# Altium project BMS_2020.PrjPcb (part 1 of 2)
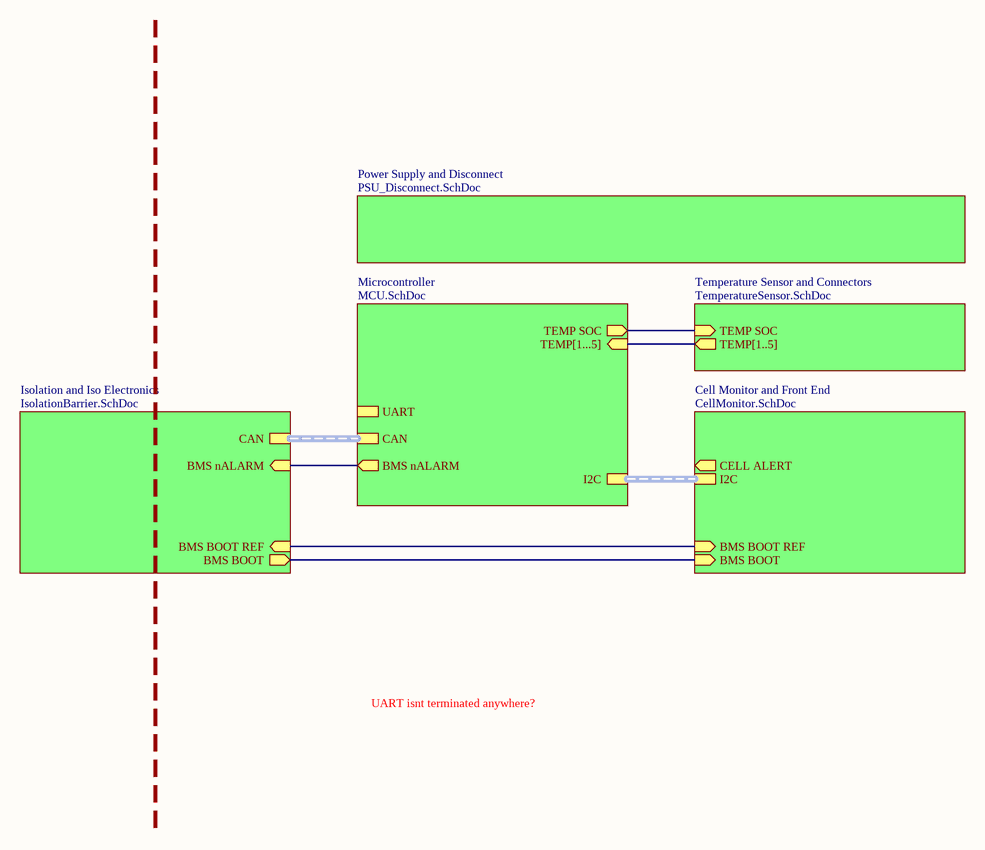
[diagram p0: Master.SchDoc]
9 sheets, 168 parts. Net scope: hierarchical (ports join the sheet entries above them; power ports are global).
Sheets:
  Master.SchDoc
    Isolation and Iso Electronics = IsolationBarrier.SchDoc
      Isolated CANBUS = CANBUS_3V3_Isolated.SchDoc
    Microcontroller = MCU.SchDoc
    Cell Monitor and Front End = CellMonitor.SchDoc
      CELL 10 INTERFACE = ExternalBalancing.SchDoc
      CELL 1 INTERFACE = ExternalBalancing.SchDoc
      CELL 2 INTERFACE = ExternalBalancing.SchDoc
      CELL 3 INTERFACE = ExternalBalancing.SchDoc
      CELL 4 INTERFACE = ExternalBalancing.SchDoc
      CELL 5 INTERFACE = ExternalBalancing.SchDoc
      CELL 6 INTERFACE = ExternalBalancing.SchDoc
      CELL 7 INTERFACE = ExternalBalancing.SchDoc
      CELL 8 INTERFACE = ExternalBalancing.SchDoc
      CELL 9 INTERFACE = ExternalBalancing.SchDoc
    Power Supply and Disconnect = PSU_Disconnect.SchDoc
    Temperature Sensor and Connectors = TemperatureSensor.SchDoc
      FlexPCBTempSensors1 = TemperatureSensors.SchDoc
      FlexPCBTempSensors2 = TemperatureSensors.SchDoc
      FlexPCBTempSensors3 = TemperatureSensors.SchDoc
      FlexPCBTempSensors4 = TemperatureSensors.SchDoc

## Sheet Master.SchDoc: BMS Master
size A4; DrawnBy: Jonn Dillon; DocumentNumber: 1; Revision: 01; SheetNumber: 1; SheetTotal: 10; Version: 01; Project: Battery Managment System 2020; PageSetup: Record=PageOptions|CenterHorizontal=True|CenterVertical=True|PrintScale=0.97|XCorrection=1.00|YCorrection=1.00|PrintKind=0|BorderSize=5000000|LeftOffset=0|BottomOffset=0|Orientation=2|PaperLength=1000|PaperWidth=1000|Scale=100|PaperSource=7|PrintQuality=-4|MediaType=1|DitherType=10|PaperKind=A4|PrintScaleMode=1

### Sub-sheets
Cell Monitor and Front End = CellMonitor.SchDoc: BMS BOOT REF (in), BMS BOOT (in), I2C (harness I2C), CELL ALERT (out)
Isolation and Iso Electronics = IsolationBarrier.SchDoc: BMS BOOT (out), CAN (harness CANBUS SERIAL), BMS nALARM (in), BMS BOOT REF (in)
Microcontroller = MCU.SchDoc: I2C (harness I2C), CAN (harness CAN), TEMP[1...5] (in), BMS nALARM (out), TEMP SOC (out), UART (harness UART)
Power Supply and Disconnect = PSU_Disconnect.SchDoc: no entries
Temperature Sensor and Connectors = TemperatureSensor.SchDoc: TEMP SOC (in), TEMP[1..5] (out)

### Nets
BMS BOOT: sheet Isolation and Iso Electronics/BMS BOOT, sheet Cell Monitor and Front End/BMS BOOT
nALARM: sheet Isolation and Iso Electronics/BMS nALARM, sheet Microcontroller/BMS nALARM
TEMP SOC: sheet Microcontroller/TEMP SOC, sheet Temperature Sensor and Connectors/TEMP SOC
NetR?#11_2: sheet Isolation and Iso Electronics/BMS BOOT REF, sheet Cell Monitor and Front End/BMS BOOT REF

### Buses and harness runs
bus sheet Microcontroller/TEMP[1...5] = sheet Temperature Sensor and Connectors/TEMP[1..5]
harness sheet Cell Monitor and Front End/I2C = sheet Microcontroller/I2C
harness sheet Isolation and Iso Electronics/CAN = sheet Microcontroller/CAN

### Notes on the sheet
- UART isnt terminated anywhere?
- Revision History:
- Sheet Title:
- Rev
- Date
- Description
- Project:
- Size:
- Drawn By:
- A3
- Number:
- Revision:
- Sheet
- Version:
- of
- QUT Motorsport
- O-120, Gardens Point
- 2 George Street
- Brisbane, QLD 4000
- Australia
- Print Date:
- Print Time:
- File Name:

## Sheet IsolationBarrier.SchDoc: Isolation Barrier
size A3; DrawnBy: Jonn Dillon; DocumentNumber: 3; Revision: 01; SheetNumber: 3; SheetTotal: 10; Version: 01; Project: Battery Management System 2020; PageSetup: Record=PageOptions|CenterHorizontal=True|CenterVertical=True|PrintScale=0.97|XCorrection=1.00|YCorrection=1.00|PrintKind=0|BorderSize=5000000|LeftOffset=0|BottomOffset=0|Orientation=2|PaperLength=1000|PaperWidth=1000|Scale=100|PaperSource=7|PrintQuality=-4|MediaType=1|DitherType=10|PaperKind=A4|PrintScaleMode=1
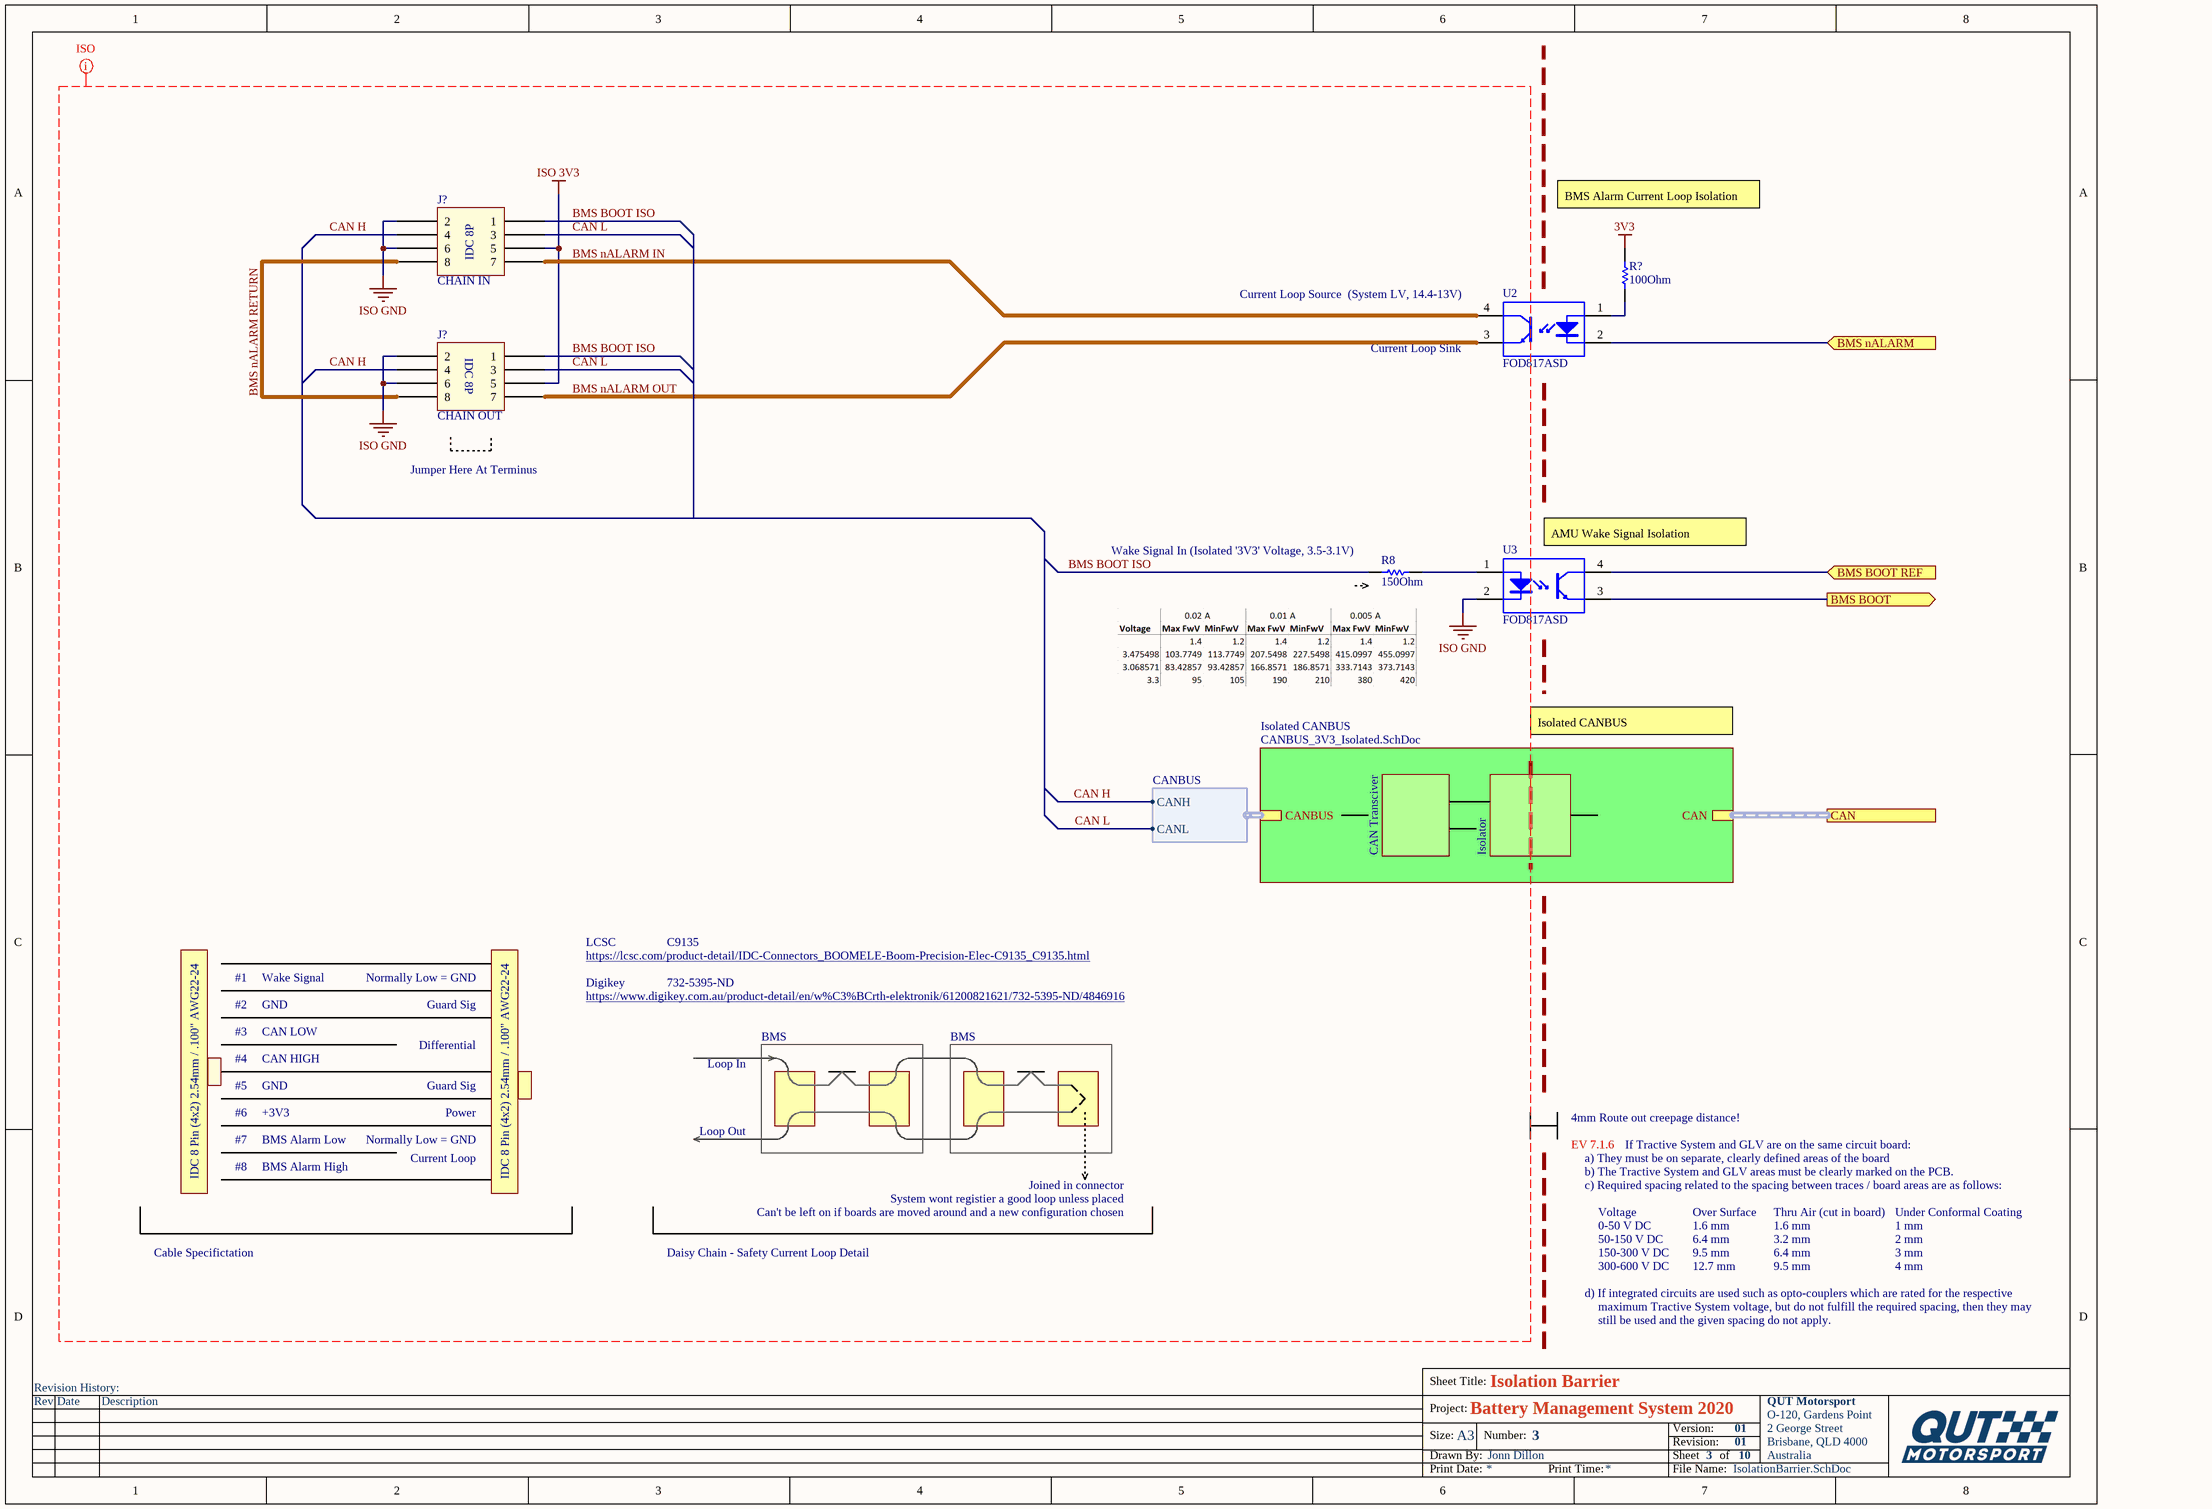
[diagram p1: IsolationBarrier.SchDoc]

### Parts
(Parts that share a designator on the sheet are numbered #1, #2 ... from top to bottom, then left to right.)
J?#1  CHAIN IN  [IDC_8P]
J?#2  CHAIN OUT  [IDC_8P]
R8  150Ohm  [RESC1608X55X30NL15T15]
R?#1  100Ohm  [RESC1608X55X25ML10T15]
U2  FOD817ASD  [FAIR-MDIP-4_V]
U3  FOD817ASD  [FAIR-MDIP-4_V]

### Sub-sheets
Isolated CANBUS = CANBUS_3V3_Isolated.SchDoc: CANBUS (harness CANBUS), CAN

### Ports
BMS BOOT (out), BMS BOOT REF (in), BMS nALARM (in), CAN (harness CANBUS SERIAL)

### Harnesses
CANBUS: CANH, CANL

### Nets
3V3: R?#1.2
ISO 3V3: J?#1.5 J?#2.5
ISO GND: J?#1.2 J?#1.6 J?#2.2 J?#2.6 U3.2(CATHODE)
BMS BOOT: U3.3(EMITTER) ; port BMS BOOT
BMS BOOT ISO: J?#1.1 J?#2.1 R8.1
BMS nALARM IN: J?#1.7 U2.4(COLLECTOR)
BMS nALARM OUT: J?#2.7 U2.3(EMITTER)
BMS nALARM RETURN: J?#1.8 J?#2.8
CAN H: J?#1.4 J?#2.4 ; sheet Isolated CANBUS/CANBUS.CANH
CAN L: J?#1.3 J?#2.3 ; sheet Isolated CANBUS/CANBUS.CANL
nALARM: U2.2(CATHODE) ; port BMS nALARM
NetR8_2: R8.2 U3.1(ANODE)
NetR?#1_1: R?#1.1 U2.1(ANODE)
NetR?#11_2: U3.4(COLLECTOR) ; port BMS BOOT REF

### Buses and harness runs
harness port CAN = sheet Isolated CANBUS/CAN

### Layout directives
mark named ISO: BMS BOOT ISO, BMS nALARM IN, BMS nALARM OUT, BMS nALARM RETURN, CAN H, CAN L, ISO 3V3, ISO GND

### Notes on the sheet
- BMS Alarm Current Loop Isolation
- (near U2) Current Loop Source  (System LV, 14.4-13V)
- (near U2) Current Loop Sink
- Jumper Here At Terminus
- (near R8) Wake Signal In (Isolated '3V3' Voltage, 3.5-3.1V)
- (near U3) AMU Wake Signal Isolation
- Isolated CANBUS
- CAN Transciver
- Isolator
- #1
- Wake Signal
- Normally Low = GND
- LCSC
- https://lcsc.com/product-detail/IDC-Connectors_BOOMELE-Boom-Precision-Elec-C9135_C9135.html
- Digikey
- 732-5395-ND
- C9135
- #2
- #3
- #4
- CAN LOW
- CAN HIGH
- GND
- Differential
- Guard Sig
- https://www.digikey.com.au/product-detail/en/w%C3%BCrth-elektronik/61200821621/732-5395-ND/4846916
- BMS
- #5
- #6
- +3V3
- Power
- Loop In
- 4mm Route out creepage distance!
- IDC 8 Pin (4x2) 2.54mm / .100" AWG22-24
- #7
- #8
- BMS Alarm High
- BMS Alarm Low
- Current Loop
- Loop Out
- Joined in connector
- EV 7.1.6
- a) They must be on separate, clearly defined areas of the board
- b) The Tractive System and GLV areas must be clearly marked on the PCB.
- c) Required spacing related to the spacing between traces / board areas are as follows:
- If Tractive System and GLV are on the same circuit board:
- Cable Specifictation
- Daisy Chain - Safety Current Loop Detail
- System wont registier a good loop unless placed
- Can't be left on if boards are moved around and a new configuration chosen
- Voltage
- 0-50 V DC
- 50-150 V DC
- 150-300 V DC
- Over Surface
- 1.6 mm
- 6.4 mm
- 9.5 mm
- Thru Air (cut in board)
- 3.2 mm
- Under Conformal Coating
- 1 mm
- 2 mm
- 3 mm
- d) If integrated circuits are used such as opto-couplers which are rated for the respective
- 300-600 V DC
- maximum Tractive System voltage, but do not fulfill the required spacing, then they may
- still be used and the given spacing do not apply.
- 12.7 mm
- 4 mm
- Revision History:
- Sheet Title:
- Rev
- Date
- Description
- Project:
- Size:
- Drawn By:
- A3
- Number:
- Revision:
- Sheet
- Version:
- of
- QUT Motorsport
- O-120, Gardens Point
- 2 George Street
- Brisbane, QLD 4000
- Australia
- Print Date:
- Print Time:
- File Name:
- (in symbol IDC_8P_2x5) IDC 8P

### Library data of the parts
J?#1 J?#2 = IDC_8P_2x5
R8 = CMP-2000-00723-1: Part Number: ERJ-3GEYJ151V; Manufacturer: Panasonic
R?#1 = CMP-2000-05021-1: Chip Resistor, 100 Ohm, +/- 5%, 50 V, 0603 (1608 Metric), RoHS, Tape and Reel; Manufacturer: Yageo; Temperature Coefficient: 100PPM/C; Resistance: 100Ohms; Power Rating: 100mW; Voltage Rating: 50V; Manufacturer URL: http://www.yageo.com/; Product: ThickFilmResistorsGeneralPurpose; Package Description: 2-Pin Surface Mount Device, Body 1.6 x 0.8 mm; Tolerance: 5%; Termination Style: SMD/SMT; Datasheet URL: http://www.farnell.com/datasheets/443971.pdf; Operating Temperature Range: -55Cto+155C; Packaging: Reel; Case Code - in: 0603; Package Reference: 603; Series: RC; Case Code - mm: 1608; Datasheet Version: Rev. 4, 04/2009
U2 U3 = CMP-2000-06279-1: Phototransistor Optocoupler, 4 us Rise, 3 us Fall, 5000 Vrms, -55 to 110 degC, 4-Pin MDIP, RoHS, Tape and Reel; Manufacturer: Fairchild Semiconductor; Maximum Input Current: 50mA; Maximum Forward Voltage: 1.4V; Maximum Reverse Voltage: 6V; Product Width: 7mm(Max); Input Type: DC; Maximum Current Transfer Ratio: 160%; Maximum Rise Time: 18us; Typical Rise Time: 4us; Typical Forward Voltage: 1.2V; Product Length: 5.1mm(Max); Package Version: 10/2014; Maximum Collector Emitter Saturation Voltage: 200mV; Number of Channels per Chip: 1; Product Height: 4mm(Max); Maximum Power Dissipation: 200mW; Typical Fall Time: 3us; Maximum Collector Emitter Voltage: 70V; Pin_Count: 4; Minimum Current Transfer Ratio: 80%; Output Device: Transistor; Manufacturer URL: https://www.fairchildsemi.com/; Family: FOD817; Supplier_Package: PDIPSMDBlack; Datasheet URL: https://www.fairchildsemi.com/datasheets/FO/FOD817.pdf; Package Description: 4-Pin Surface Mount Device, Body 6.5 x 4.6 mm, Pitch 2.54 mm; Mounting Technology: SurfaceMount; Package Reference: MDIP 4L; Maximum Operating Temperature: 110C; Mounting: SurfaceMount; Maximum Fall Time: 18us; Package URL: https://www.fairchildsemi.com/package-drawings/N0/N04C.pdf; Product Type: TransistorandPhotovoltaicOutputPhotoCouplers; Datasheet Version: Rev. 2.8, 11/2015; Minimum Operating Temperature: -55C; Maximum Collector Current: 50mA; Packaging: TapeandReel; Minimum Isolation Voltage: 5000Vrms; Output Type: DC

## Sheet CANBUS_3V3_Isolated.SchDoc: Isolated CANBUS @ 3V3
size A3; DrawnBy: Jonn Dillon; DocumentNumber: 4; Revision: 01; SheetNumber: 4; SheetTotal: 10; Version: 01; Project: Battery Managment System 2020; PageSetup: Record=PageOptions|CenterHorizontal=True|CenterVertical=True|PrintScale=0.97|XCorrection=1.00|YCorrection=1.00|PrintKind=0|BorderSize=5000000|LeftOffset=0|BottomOffset=0|Orientation=2|PaperLength=1000|PaperWidth=1000|Scale=100|PaperSource=7|PrintQuality=-4|MediaType=1|DitherType=10|PaperKind=A4|PrintScaleMode=1
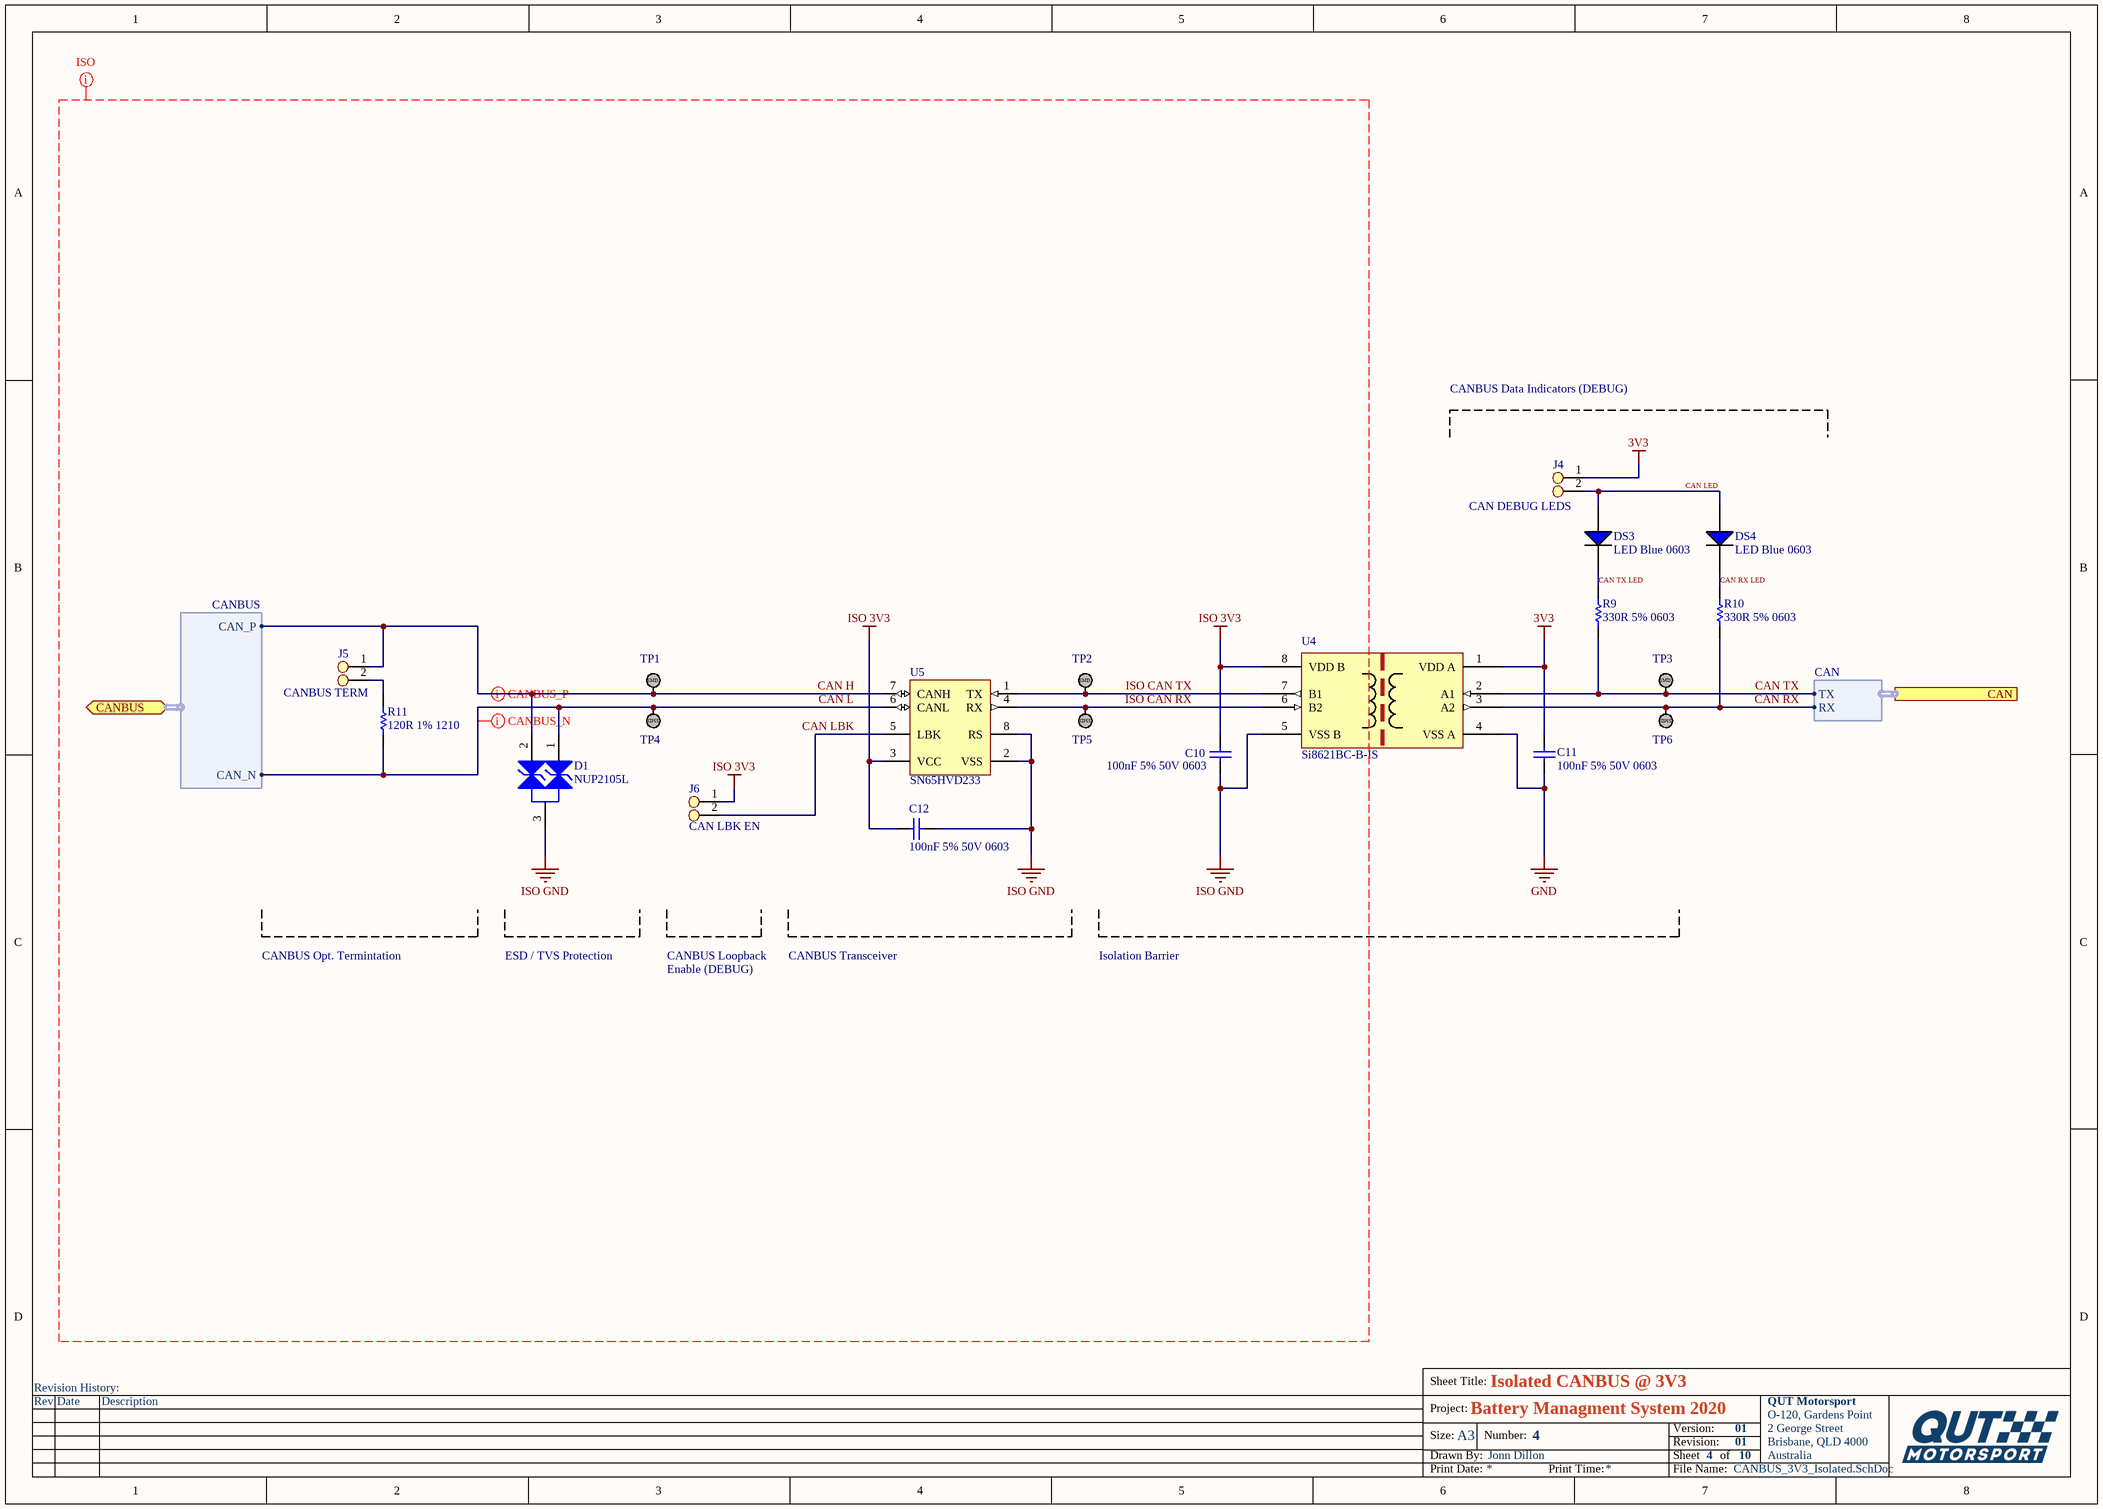
[diagram p2: CANBUS_3V3_Isolated.SchDoc]

### Parts
C10  100nF 5% 50V 0603  [CAPC1608X90X35NL15T15]
C11  100nF 5% 50V 0603  [CAPC1608X90X35NL15T15]
C12  100nF 5% 50V 0603  [CAPC1608X90X35NL15T15]
D1  NUP2105L  [NUP2105L]
DS3  LED Blue 0603  [LED BLUE 0603]
DS4  LED Blue 0603  [LED BLUE 0603]
J4  CAN DEBUG LEDS  [Jumper_2Way_Pin]
J5  CANBUS TERM  [Jumper_2Way_Pin]
J6  CAN LBK EN  [Jumper_2Way_Pin]
R9  330R 5% 0603  [RESC1608X55X25LL10T15]
R10  330R 5% 0603  [RESC1608X55X25LL10T15]
R11  120R 1% 1210  [RESC1210(3225)_M]
TP1  TestPoint_SMD  [TestPointSMD]  (value not drawn)
TP2  TestPoint_SMD  [TestPointSMD]  (value not drawn)
TP3  TestPoint_SMD  [TestPointSMD]  (value not drawn)
TP4  TestPoint_SMD  [TestPointSMD]  (value not drawn)
TP5  TestPoint_SMD  [TestPointSMD]  (value not drawn)
TP6  TestPoint_SMD  [TestPointSMD]  (value not drawn)
U4  Si8621BC-B-IS
U5  SN65HVD233  [SN65HVD233DR]

### Ports
CAN (harness CAN), CANBUS (bidir, harness CANBUS)

### Harnesses
CANBUS: CAN_P, CAN_N
CAN: RX, TX

### Nets
3V3: C11.1 J4.1 U4.1(VDD_A)
GND: C11.2 U4.4(VSS_A)  [project net CF0]
ISO 3V3: C10.1 C12.1 J6.1 U4.8(VDD_B) U5.3(VCC)
ISO GND: C10.2 C12.2 D1.3 U4.5(VSS_B) U5.2(VSS) U5.8(RS)
CAN H: D1.2 J5.1 TP1.1 U5.7(CANH) ; port CANBUS.CAN_P
CAN L: D1.1 R11.1 TP4.1 U5.6(CANL) ; port CANBUS.CAN_N
CAN LBK: J6.2 U5.5(LBK)
CAN LED: DS3.1(A) DS4.1(A) J4.2
CAN RX: R10.1 TP6.1 U4.3(A2) ; port CAN.RX
CAN RX LED: DS4.2(C) R10.2
CAN TX: R9.1 TP3.1 U4.2(A1) ; port CAN.TX
CAN TX LED: DS3.2(C) R9.2
ISO CAN RX: TP5.1 U4.6(B2) U5.4(RX)
ISO CAN TX: TP2.1 U4.7(B1) U5.1(TX)
NetJ5_2: J5.2 R11.2

### Layout directives
mark named ISO: CAN H, CAN L, CAN LBK, ISO 3V3, ISO CAN RX, ISO CAN TX, ISO GND
differential pair; differential pair class CANBUS: CAN H, CAN L

### Notes on the sheet
- CANBUS Data Indicators (DEBUG)
- CANBUS Opt. Termintation
- ESD / TVS Protection
- CANBUS Loopback
- Enable (DEBUG)
- CANBUS Transceiver
- Isolation Barrier
- Revision History:
- Sheet Title:
- Rev
- Date
- Description
- Project:
- Size:
- Drawn By:
- A3
- Number:
- Revision:
- Sheet
- Version:
- of
- QUT Motorsport
- O-120, Gardens Point
- 2 George Street
- Brisbane, QLD 4000
- Australia
- Print Date:
- Print Time:
- File Name:
- (in symbol TestPoint_SMD) SMD

### Library data of the parts
C10-C12 = CMP-2006-02049-1: Manufacturer: AVX Interconnect / Elco; Part Number: 06035C104JAT2A
J4-J6 = Jumper_2Way_Side_Pins: Jumper_2Way_Pins
R9 R10 = CMP-2000-06958-1: Chip Resistor, 330 Ohm, +/- 5%, 50 V, -55 to 155 degC, 0603 (1608 Metric), -40 to 155 degC, RoHS, Tape and Reel; Manufacturer: Yageo; Temperature Coefficient: ±100ppm/°C; Power Rating: 100mW; Voltage Rating: 50V; Product Range: RCSeries; SVHC: ToBeAdvised; Resistance: 330ohm; Resistor Element Type: ThickFilm; Resistor Case Style: 0603[1608Metric]; Manufacturer URL: http://www.yageo.com/; Packaging: CutTape; Mounting Technology: SurfaceMount; Automotive Qualification Standard: -; MSL: MSL1-Unlimited; Datasheet URL: http://www.yageo.com/documents/recent/PYu-RC_Group_51_RoHS_L_7.pdf; Package Reference: 0603; Package Description: 2-Pin Surface Mount Device, Body 1.6 x 0.8 mm; Resistance Tolerance: ±5%; Datasheet Version: Rev. 7, 05/2017
R11 = CMP-1015-00405-1: 120R 0.5W 1% 1210 (3225 Metric)  SMD; Case-Metric: 3225; Value: 120.00 Ohm; Case-EIA: 1210; Technology: SMT; Tolerance: 1 %; Power: 0.5 W
D1 = NUP2105L: ComponentLink1Description: Datasheet; ComponentLink1URL: https://www.onsemi.cn/PowerSolutions/document/NUP2105L-D.PDF; Parameter 1: *; ComponentLink2Description: LCSC; ComponentLink2URL: https://lcsc.com/product-detail/TVS_ON-Semiconductor-NUP2105LT1G_C14486.html; ComponentLink3Description: Digikey; ComponentLink3URL: https://www.digikey.com.au/product-detail/en/on-semiconductor/SZNUP2105LT1G/SZNUP2105LT1GOSCT-ND/3487669
U4 = Si8621BC-B-IS: ComponentLink1Description: Digikey; ComponentLink1URL: https://www.digikey.com.au/product-detail/en/silicon-labs/SI8621BC-B-ISR/336-4774-1-ND/8611005; ComponentLink2Description: Datasheet; ComponentLink2URL: https://www.silabs.com/documents/public/data-sheets/si861x-2x-datasheet.pdf
U5 = SN65HVD233: ComponentLink1Description: LCSC; ComponentLink1URL: https://lcsc.com/product-detail/CAN-ICs_Texas-Instruments_SN65HVD233DRG4_Texas-Instruments-Texas-Instruments-SN65HVD233DRG4_C61643.html; ComponentLink2Description: Digikey; ComponentLink2URL: https://www.digikey.com.au/product-detail/en/texas-instruments/SN65HVD233DR/296-35967-1-ND/4134960; ComponentLink3Description: Datasheet; ComponentLink3URL: https://www.ti.com/lit/ds/symlink/sn65hvd233.pdf?ts=1588560888178; ComponentLink4Description: Ti Product Page; ComponentLink4URL: https://www.ti.com/product/SN65HVD233

## Sheet MCU.SchDoc: Microcontroller
size A3; DrawnBy: Zoe Goodward; DocumentNumber: 2; Revision: 01; SheetNumber: 2; SheetTotal: 10; Version: 01; Project: Battery Managment System 2020; PageSetup: Record=PageOptions|CenterHorizontal=True|CenterVertical=True|PrintScale=0.97|XCorrection=1.00|YCorrection=1.00|PrintKind=0|BorderSize=5000000|LeftOffset=0|BottomOffset=0|Orientation=2|PaperLength=1000|PaperWidth=1000|Scale=100|PaperSource=7|PrintQuality=-4|MediaType=1|DitherType=10|PaperKind=A4|PrintScaleMode=1
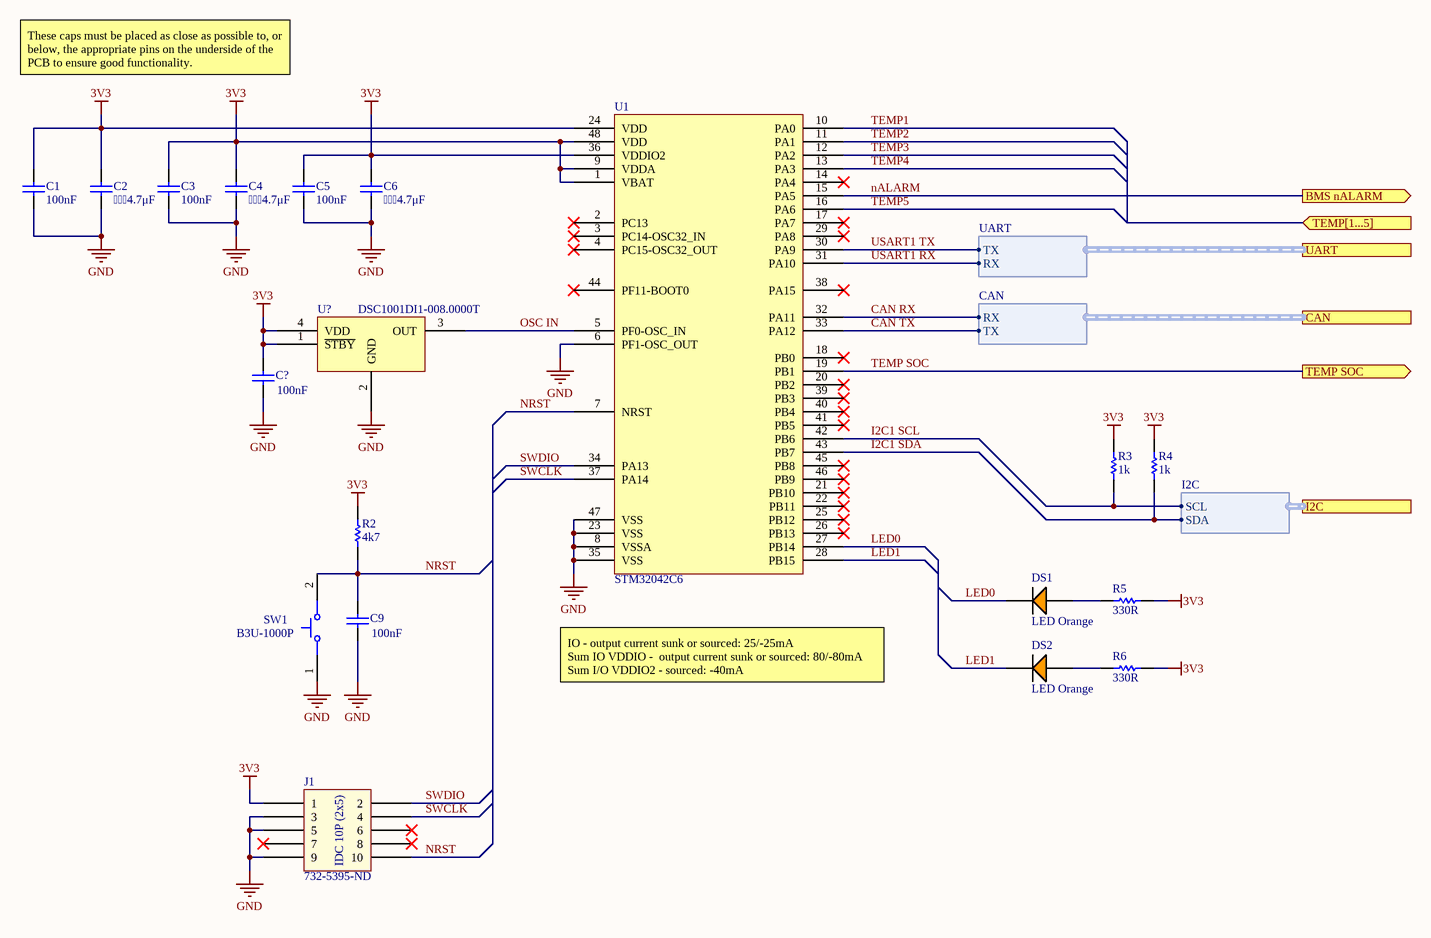
[diagram p3: MCU.SchDoc]

### Parts
(Parts that share a designator on the sheet are numbered #1, #2 ... from top to bottom, then left to right.)
C1  100nF  [CAPC1608X90X35ML15T15]
C2  4.7μF  [CAPC1608X87X35NL15T15]
C3  100nF  [CAPC1608X90X35ML15T15]
C4  4.7μF  [CAPC1608X87X35NL15T15]
C5  100nF  [CAPC1608X90X35ML15T15]
C6  4.7μF  [CAPC1608X87X35NL15T15]
C9  100nF  [CAPC0603(1608)100_N]
C?#1  100nF  [CAPC0603(1608)100_N]
DS1  LED Orange  [LED ORANGE 0603]
DS2  LED Orange  [LED ORANGE 0603]
J1  732-5395-ND  [IDC_10P]
R2  4k7  [RESC0603(1608)_N]
R3  1k  [RESC1608X55X30ML15T15]
R4  1k  [RESC1608X55X30ML15T15]
R5  330R  [RESC0603(1608)_L]
R6  330R  [RESC0603(1608)_L]
SW1  B3U-1000P  [OMRON-B3U-1000_V]
U1  STM32042C6  [STM32F042C6]
U?#1  DSC1001DI1-008.0000T  [DSC1001DI1-008.0000TCT-ND]

### Ports
BMS nALARM (out), CAN (harness CAN), I2C (harness I2C), TEMP SOC (out), TEMP[1...5] (in), UART (harness UART)

### Harnesses
I2C: SCL, SDA
CAN: RX, TX
UART: TX, RX

### Nets
3V3: C1.2 C2.2 C3.2 C4.2 C5.2 C6.2 C?#1.2 J1.1 R2.2 R3.2 R4.2 R5.1 R6.1 U1.1(VBAT) U1.9(VDDA) U1.24(VDD) U1.36(VDDIO2) U1.48(VDD) U?#1.1(~{STBY}) U?#1.4(VDD)
GND: C1.1 C2.1 C3.1 C4.1 C5.1 C6.1 C9.1 C?#1.1 J1.3 J1.5 J1.9 SW1.1 U1.6(PF1-OSC_OUT) U1.8(VSSA) U1.23(VSS) U1.35(VSS) U1.47(VSS) U?#1.2(GND)  [project net CF0]
CAN RX: U1.32(PA11) ; port CAN.RX
CAN TX: U1.33(PA12) ; port CAN.TX
I2C1 SCL: R3.1 U1.42(PB6) ; port I2C.SCL  [project net I2C SCL]
I2C1 SDA: R4.1 U1.43(PB7) ; port I2C.SDA  [project net I2C SDA]
LED0: DS1.2(C) U1.27(PB14)
LED1: DS2.2(C) U1.28(PB15)
nALARM: U1.15(PA5) ; port BMS nALARM
NRST: C9.2 J1.10 R2.1 SW1.2 U1.7(NRST)
OSC IN: U1.5(PF0-OSC_IN) U?#1.3(OUT)
SWCLK: J1.4 U1.37(PA14)
SWDIO: J1.2 U1.34(PA13)
TEMP1: U1.10(PA0)
TEMP2: U1.11(PA1)
TEMP3: U1.12(PA2)
TEMP4: U1.13(PA3)
TEMP5: U1.16(PA6)
TEMP SOC: U1.19(PB1) ; port TEMP SOC
USART1 RX: U1.31(PA10) ; port UART.RX
USART1 TX: U1.30(PA9) ; port UART.TX
NetDS1_1: DS1.1(A) R5.2
NetDS2_1: DS2.1(A) R6.2

Not connected (* = marked no-connect by the designer): J1 6* 7* 8*; U1 2(PC13)* 3(PC14-OSC32_IN)* 4(PC15-OSC32_OUT)* 14(PA4)* 17(PA7)* 18(PB0)* 20(PB2)* 21(PB10)* 22(PB11)* 25(PB12)* 26(PB13)* 29(PA8)* 38(PA15)* 39(PB3)* 40(PB4)* 41(PB5)* 44(PF11-BOOT0)* 45(PB8)* 46(PB9)*

### Notes on the sheet
- These caps must be placed as close as possible to, or below, the appropriate pins on the underside of the PCB to ensure good functionality.
- IO - output current sunk or sourced: 25/-25mA
  Sum IO VDDIO -  output current sunk or sourced: 80/-80mA
  Sum I/O VDDIO2 - sourced: -40mA
- Revision History:
- Sheet Title:
- Rev
- Date
- Description
- Project:
- Size:
- Drawn By:
- A3
- Number:
- Revision:
- Sheet
- Version:
- of
- QUT Motorsport
- O-120, Gardens Point
- 2 George Street
- Brisbane, QLD 4000
- Australia
- Print Date:
- Print Time:
- File Name:
- (in symbol IDC_10P_2x5) IDC 10P (2x5)

### Library data of the parts
C1 C3 C5 = CMP-2006-04387-1: Manufacturer: AVX Interconnect / Elco; Part Number: 06035C104K4T4A
C2 C4 C6 = CMP-2006-03238-1: Part Number: C0603C475K8PACTU; Manufacturer: Kemet
C9 C?#1 = CMP-1035-02584-1: CAP 100nF 16V ±10% 0603 (1608 Metric) Thickness 1mm SMD; Tolerance: Â±10%; Case-EIA: 0603; Case-Metric: 1608; Technology: SMT; Max Thickness: 1 mm; Value: 100nF; Rated Voltage: 16 V
DS1 DS2 = LED ORANGE 0603
J1 = IDC_10P_2x5
R2 = CMP-1012-00098-1: 10K 0.1W 5% 0603 (1608 Metric)  SMD; Case-EIA: 0603; Value: 10000.00 Ohm; Case-Metric: 1608; Technology: SMT; Tolerance: 5 %; Power: 0.1 W
R3 R4 = CMP-2000-00703-1: Part Number: ERJ-3GEYJ102V; Manufacturer: Panasonic
R5 R6 = CMP-1012-00062-1: 330R 0.1W 5% 0603 (1608 Metric)  SMD; Value: 330.00 Ohm; Case-EIA: 0603; Case-Metric: 1608; Tolerance: 5 %; Power: 0.1 W; Technology: SMT
SW1 = CMP-2100-03586-1: Ultra-Small Tactile Switch, 0.05 A, 12 V, -25 to 70 degC, 2-Pin SMD, RoHS, Tape and Reel; Manufacturer: Omron Electronic Components; Operating Force: 1.5N; Current Rating: 50mA; Voltage Rating (DC): 12V; Electrical Life: 200000Cycles; Actuator Length: 0.4mm; Insulation Resistance: 100MOhm; Switch Travel: 0.15mm; Throw Configuration: SPST; Illumination Type: Illuminated; Width: 3mm; Weight: 0.022g; Datasheet Version: 42005.0; Datasheet URL: http://www.omron.com/ecb/products/pdf/en-b3u.pdf; Height: 1.2mm; Package Quantity: 1; REACH SVHC: Unknown; Contact Current Rating: 50mA; Contact Material: Silver; Max Current Rating: 50mA; Package Reference: B3U-1000; Termination: SMD/SMT; Packaging: TapeandReel; Manufacturer URL: http://www.omron.com/; RoHSCompliant: true; Mount: SurfaceMount; Length: 4mm; Min Operating Temperature: -25degC; Depth: 2.5mm; Lead Free: LeadFree; Case/Package: SMD/SMT; Package Description: 2-Pin Surface Mount Device, Body 3 x 2.5 mm; Max Operating Temperature: 70degC; Orientation: Straight
U1 = STM32042C6: ARM® Cortex®-M0 STM32F0 Microcontroller IC 32-Bit 48MHz 32KB (32K x 8) FLASH 48-LQFP (7x7); ComponentLink1Description: Digikey; ComponentLink1URL: https://www.digikey.com.au/product-detail/en/stmicroelectronics/STM32F042C6T6TR/497-19319-1-ND/10063344; ComponentLink2Description: Datasheet; ComponentLink2URL: https://www.st.com/resource/en/datasheet/stm32f042k6.pdf
U?#1 = DSC1001DI1-008.0000T: on 8MHz XO (Standard) CMOS Oscillator 1.8 ~ 3.3V Standby (Power Down) 4-SMD, No Lead

## Sheet CellMonitor.SchDoc: Cell Monitor
size A3; DrawnBy: Sam Haines; DocumentNumber: 5; Revision: 01; SheetNumber: 5; SheetTotal: 10; Version: 01; Project: Battery Managment System 2020; PageSetup: Record=PageOptions|CenterHorizontal=True|CenterVertical=True|PrintScale=0.97|XCorrection=1.00|YCorrection=1.00|PrintKind=0|BorderSize=5000000|LeftOffset=0|BottomOffset=0|Orientation=2|PaperLength=1000|PaperWidth=1000|Scale=100|PaperSource=7|PrintQuality=-4|MediaType=1|DitherType=10|PaperKind=A4|PrintScaleMode=1
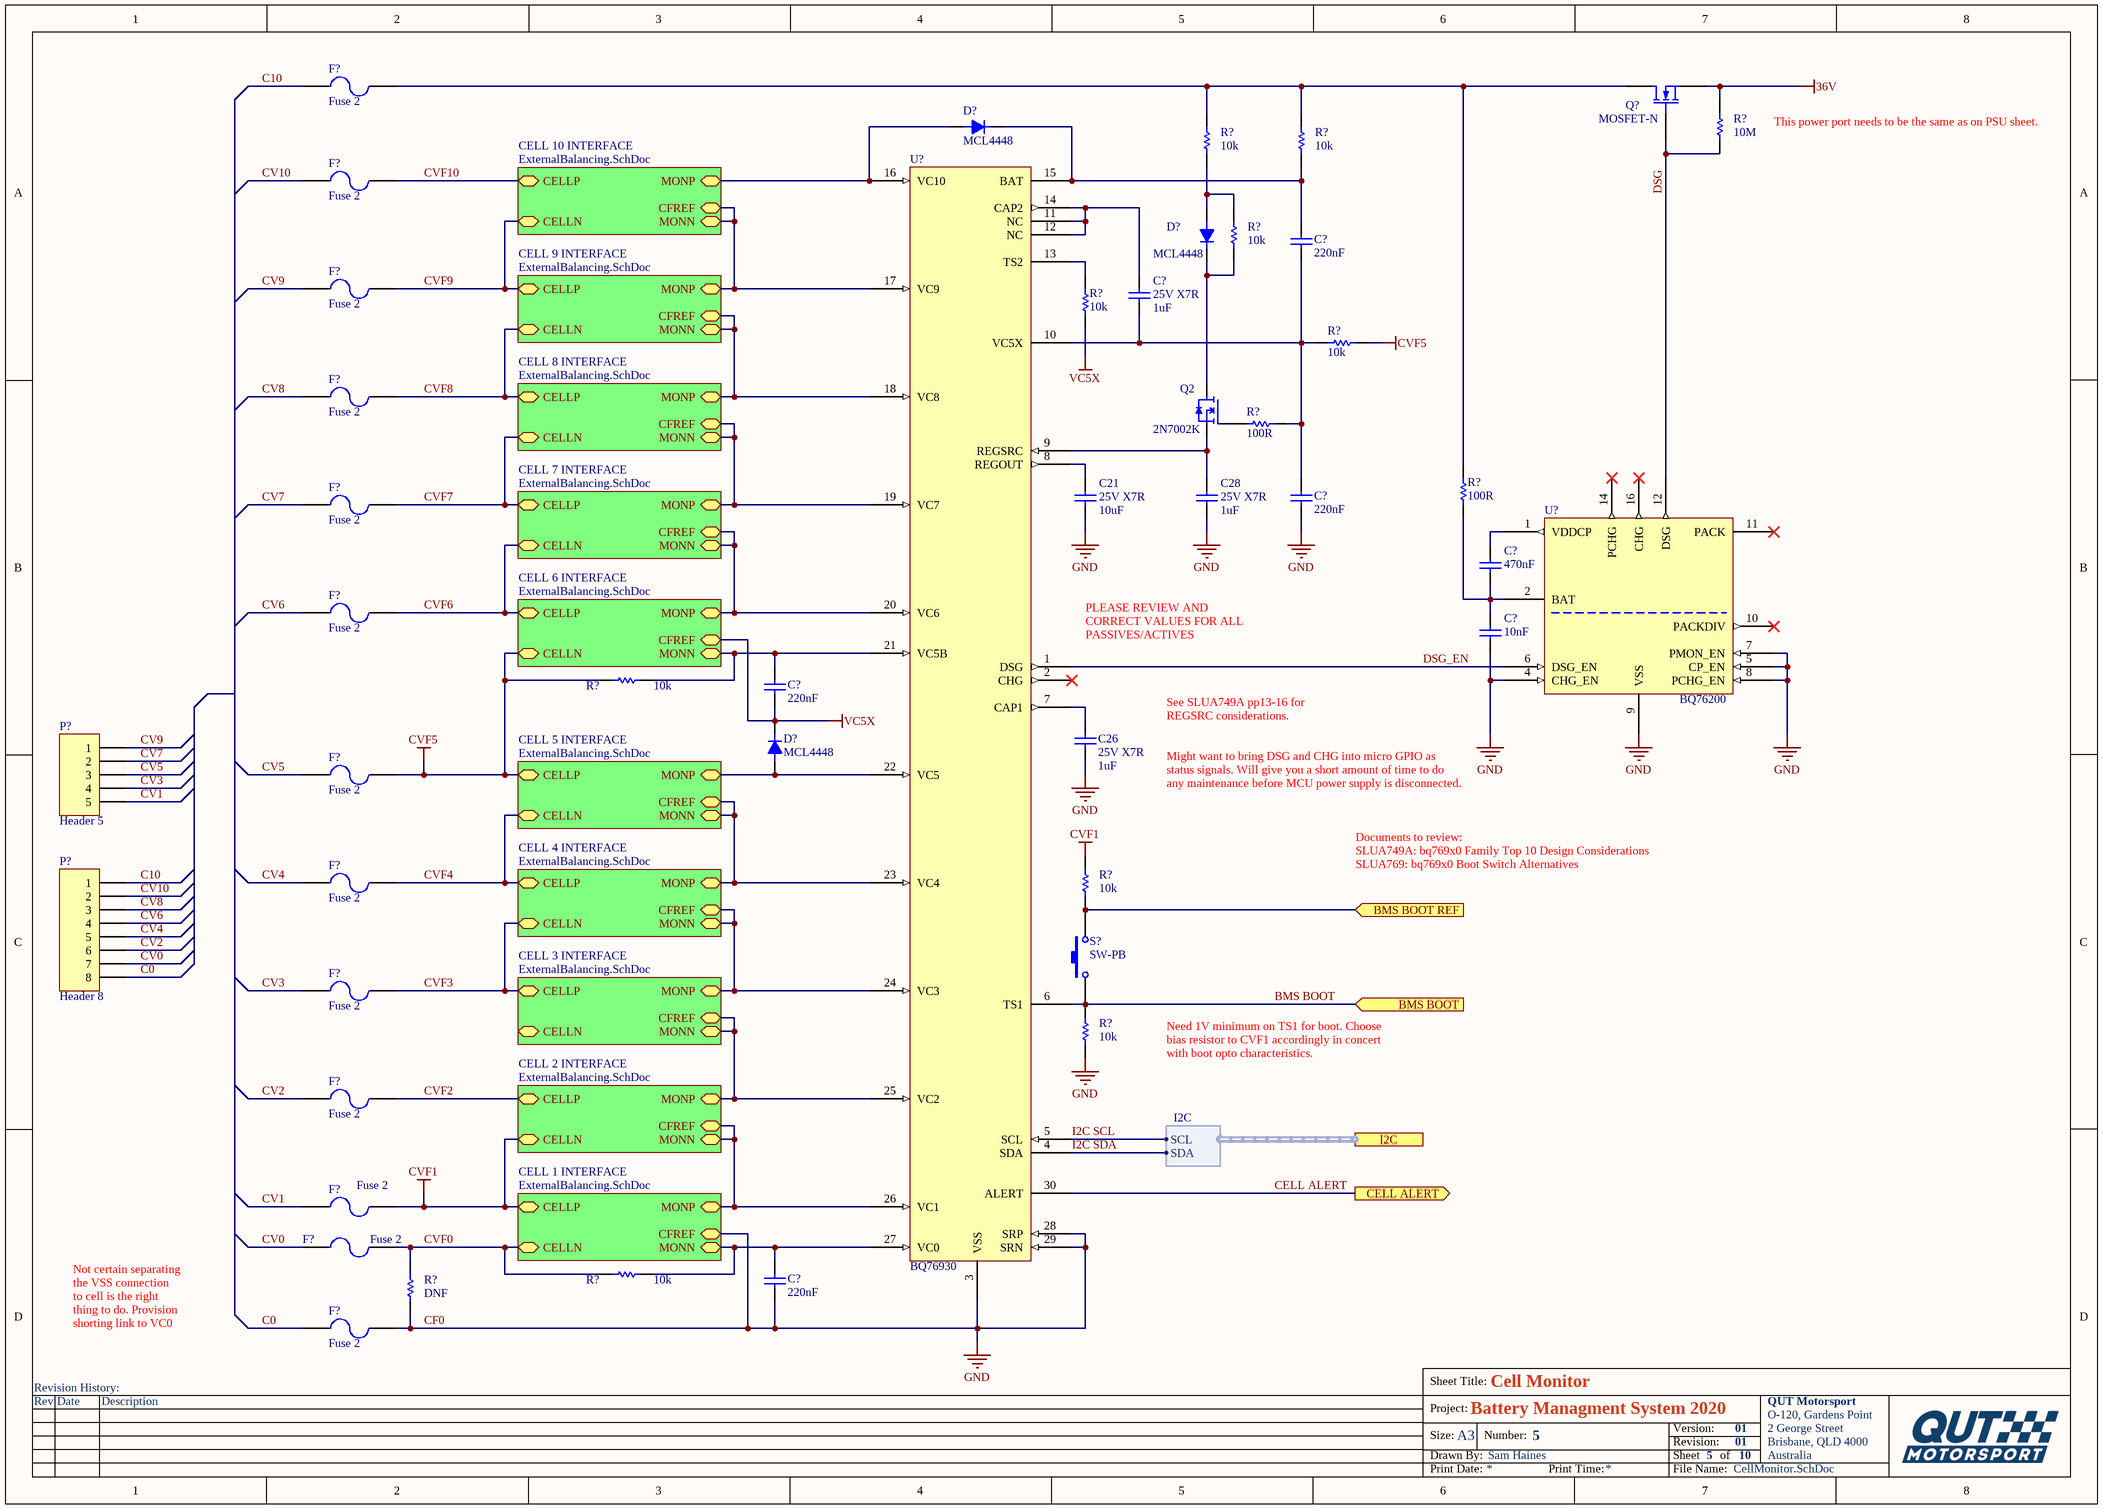
[diagram p4: CellMonitor.SchDoc]

### Parts
(Parts that share a designator on the sheet are numbered #1, #2 ... from top to bottom, then left to right.)
C21  25V X7R  value 10uF  [1206-CAP-1.8H]
C26  25V X7R  value 1uF  [0603-CAP-X7R-0.8H]
C28  25V X7R  value 1uF  [0603-CAP-X7R-0.8H]
C?#2  220nF  [CAPC2013X145X50ML20T25]
C?#3  25V X7R  value 1uF  [0603-CAP-X7R-0.8H]
C?#4  220nF  [CAPC2013X145X50ML20T25]
C?#5  470nF  [CAPC2013X145X50ML20T25]
C?#6  10nF  [CAPC2013X145X50ML20T25]
C?#7  220nF  [CAPC2013X145X50ML20T25]
C?#8  220nF  [CAPC2013X145X50ML20T25]
D?#1  MCL4448  [MICRO-MELF]
D?#2  MCL4448  [MICRO-MELF]
D?#3  MCL4448  [MICRO-MELF]
F?#1  Fuse 2  [PIN-W2/E2.8]
F?#2  Fuse 2  [PIN-W2/E2.8]
F?#3  Fuse 2  [PIN-W2/E2.8]
F?#4  Fuse 2  [PIN-W2/E2.8]
F?#5  Fuse 2  [PIN-W2/E2.8]
F?#6  Fuse 2  [PIN-W2/E2.8]
F?#7  Fuse 2  [PIN-W2/E2.8]
F?#8  Fuse 2  [PIN-W2/E2.8]
F?#9  Fuse 2  [PIN-W2/E2.8]
F?#10  Fuse 2  [PIN-W2/E2.8]
F?#11  Fuse 2  [PIN-W2/E2.8]
F?#12  Fuse 2  [PIN-W2/E2.8]
F?#13  Fuse 2  [PIN-W2/E2.8]
P?#1  Header 5  [HDR1X5]
P?#2  Header 8  [HDR1X8]
Q2  2N7002K  [SOT23-3-GDS]
Q?  MOSFET-N  [E3]
R?#2  value 10M  [0603-RES]  (hidden comment: Resistor, SMD 10k 1% 0603)
R?#3  value 10k  [0603-RES]  (hidden comment: Resistor, SMD 10k 1% 0603)
R?#4  value 10k  [0603-RES]  (hidden comment: Resistor, SMD 10k 1% 0603)
R?#5  value 10k  [0603-RES]  (hidden comment: Resistor, SMD 10k 1% 0603)
R?#6  value 10k  [0603-RES]  (hidden comment: Resistor, SMD 10k 1% 0603)
R?#7  value 10k  [0603-RES]  (hidden comment: Resistor, SMD 10k 1% 0603)
R?#8  value 100R  [0603-RES]  (hidden comment: Resistor, SMD 10k 1% 0603)
R?#9  value 100R  [0603-RES]  (hidden comment: Resistor, SMD 10k 1% 0603)
R?#10  value 10k  [0603-RES]  (hidden comment: Resistor, SMD 10k 1% 0603)
R?#11  value 10k  [0603-RES]  (hidden comment: Resistor, SMD 10k 1% 0603)
R?#12  value 10k  [0603-RES]  (hidden comment: Resistor, SMD 10k 1% 0603)
R?#13  value 10k  [0603-RES]  (hidden comment: Resistor, SMD 10k 1% 0603)
R?#14  value DNF  [0603-RES]  (hidden comment: Resistor, SMD 10k 1% 0603)
S?  SW-PB  [SPST-2]
U?#2  BQ76200  [TSSOP16]
U?#3  BQ76930  [TSSOP50P640X120-30N]

### Sub-sheets
CELL 1 INTERFACE = ExternalBalancing.SchDoc: CFREF (bidir), MONP (bidir), MONN (bidir), CELLP (bidir), CELLN (bidir)
CELL 2 INTERFACE = ExternalBalancing.SchDoc: CFREF (bidir), MONP (bidir), MONN (bidir), CELLP (bidir), CELLN (bidir)
CELL 3 INTERFACE = ExternalBalancing.SchDoc: CFREF (bidir), MONP (bidir), MONN (bidir), CELLP (bidir), CELLN (bidir)
CELL 4 INTERFACE = ExternalBalancing.SchDoc: CFREF (bidir), MONP (bidir), MONN (bidir), CELLP (bidir), CELLN (bidir)
CELL 5 INTERFACE = ExternalBalancing.SchDoc: CFREF (bidir), MONP (bidir), MONN (bidir), CELLP (bidir), CELLN (bidir)
CELL 6 INTERFACE = ExternalBalancing.SchDoc: CFREF (bidir), MONP (bidir), MONN (bidir), CELLP (bidir), CELLN (bidir)
CELL 7 INTERFACE = ExternalBalancing.SchDoc: CFREF (bidir), MONP (bidir), MONN (bidir), CELLP (bidir), CELLN (bidir)
CELL 8 INTERFACE = ExternalBalancing.SchDoc: CFREF (bidir), MONP (bidir), MONN (bidir), CELLP (bidir), CELLN (bidir)
CELL 9 INTERFACE = ExternalBalancing.SchDoc: CFREF (bidir), MONP (bidir), MONN (bidir), CELLP (bidir), CELLN (bidir)
CELL 10 INTERFACE = ExternalBalancing.SchDoc: CFREF (bidir), MONP (bidir), MONN (bidir), CELLP (bidir), CELLN (bidir)

### Ports
BMS BOOT (in), BMS BOOT REF (in), CELL ALERT (out), I2C (harness I2C)

### Harnesses
I2C: SDA, SCL

### Nets
36V: Q?.3(S) R?#2.1
CF0: C21.2 C26.2 C28.2 C?#4.1 C?#6.1 C?#8.1 F?#13.2 R?#12.2 R?#14.2 U?#2.4(CHG_EN) U?#2.5(CP_EN) U?#2.7(PMON_EN) U?#2.8(PCHG_EN) U?#2.9(VSS) U?#3.3(VSS) U?#3.28(SRP) U?#3.29(SRN) ; sheet CELL 1 INTERFACE/CFREF  [also labelled GND]
CVF1: F?#11.2 R?#11.1 ; sheet CELL 1 INTERFACE/CELLP, sheet CELL 2 INTERFACE/CELLN
CVF5: F?#7.2 R?#7.1 R?#10.1 ; sheet CELL 5 INTERFACE/CELLP, sheet CELL 6 INTERFACE/CELLN
VC5X: C?#7.1 D?#3.K R?#6.1 ; sheet CELL 6 INTERFACE/CFREF
BMS BOOT: R?#12.1 S?.1 U?#3.6(TS1) ; port BMS BOOT
C0: F?#13.1 P?#2.8
C10: F?#1.1 P?#2.1
CELL ALERT: U?#3.30(ALERT) ; port CELL ALERT
CV0: F?#12.1 P?#2.7
CV1: F?#11.1 P?#1.5
CV2: F?#10.1 P?#2.6
CV3: F?#9.1 P?#1.4
CV4: F?#8.1 P?#2.5
CV5: F?#7.1 P?#1.3
CV6: F?#6.1 P?#2.4
CV7: F?#5.1 P?#1.2
CV8: F?#4.1 P?#2.3
CV9: F?#3.1 P?#1.1
CV10: F?#2.1 P?#2.2
CVF0: F?#12.2 R?#13.1 R?#14.1 ; sheet CELL 1 INTERFACE/CELLN
CVF2: F?#10.2 ; sheet CELL 2 INTERFACE/CELLP
CVF3: F?#9.2 ; sheet CELL 3 INTERFACE/CELLP, sheet CELL 4 INTERFACE/CELLN
CVF4: F?#8.2 ; sheet CELL 4 INTERFACE/CELLP, sheet CELL 5 INTERFACE/CELLN
CVF6: F?#6.2 ; sheet CELL 6 INTERFACE/CELLP, sheet CELL 7 INTERFACE/CELLN
CVF7: F?#5.2 ; sheet CELL 7 INTERFACE/CELLP, sheet CELL 8 INTERFACE/CELLN
CVF8: F?#4.2 ; sheet CELL 8 INTERFACE/CELLP, sheet CELL 9 INTERFACE/CELLN
CVF9: F?#3.2 ; sheet CELL 10 INTERFACE/CELLN, sheet CELL 9 INTERFACE/CELLP
CVF10: F?#2.2 ; sheet CELL 10 INTERFACE/CELLP
DSG: Q?.2(G) R?#2.2 U?#2.12(DSG)
DSG_EN: U?#2.6(DSG_EN) U?#3.1(DSG)
I2C SCL: U?#3.5(SCL) ; port I2C.SCL
I2C SDA: U?#3.4(SDA) ; port I2C.SDA
NetC21_1: C21.1 U?#3.8(REGOUT)
NetC26_1: C26.1 U?#3.7(CAP1)
NetC28_1: C28.1 Q2.S U?#3.9(REGSRC)
NetC?#2_1: C?#2.1 C?#3.2 C?#4.2 R?#7.2 R?#8.1 U?#3.10(VC5X)
NetC?#2_2: C?#2.2 D?#1.K R?#4.2 U?#3.15(BAT)
NetC?#3_1: C?#3.1 U?#3.11(NC) U?#3.12(NC) U?#3.14(CAP2)
NetC?#5_1: C?#5.1 C?#6.2 R?#9.2 U?#2.2(BAT)
NetC?#5_2: C?#5.2 U?#2.1(VDDCP)
NetC?#7_2: C?#7.2 R?#10.2 U?#3.21(VC5B) ; sheet CELL 6 INTERFACE/MONN
NetC?#8_2: C?#8.2 R?#13.2 U?#3.27(VC0) ; sheet CELL 1 INTERFACE/MONN
NetC?_CELL_1_INTERFACE_2: U?#3.26(VC1) ; sheet CELL 1 INTERFACE/MONP, sheet CELL 2 INTERFACE/CFREF, sheet CELL 2 INTERFACE/MONN
NetC?_CELL_2_INTERFACE_2: U?#3.25(VC2) ; sheet CELL 2 INTERFACE/MONP, sheet CELL 3 INTERFACE/CFREF, sheet CELL 3 INTERFACE/MONN
NetC?_CELL_3_INTERFACE_2: U?#3.24(VC3) ; sheet CELL 3 INTERFACE/MONP, sheet CELL 4 INTERFACE/CFREF, sheet CELL 4 INTERFACE/MONN
NetC?_CELL_4_INTERFACE_2: U?#3.23(VC4) ; sheet CELL 4 INTERFACE/MONP, sheet CELL 5 INTERFACE/CFREF, sheet CELL 5 INTERFACE/MONN
NetC?_CELL_5_INTERFACE_2: D?#3.A U?#3.22(VC5) ; sheet CELL 5 INTERFACE/MONP
NetC?_CELL_6_INTERFACE_2: U?#3.20(VC6) ; sheet CELL 6 INTERFACE/MONP, sheet CELL 7 INTERFACE/CFREF, sheet CELL 7 INTERFACE/MONN
NetC?_CELL_7_INTERFACE_2: U?#3.19(VC7) ; sheet CELL 7 INTERFACE/MONP, sheet CELL 8 INTERFACE/CFREF, sheet CELL 8 INTERFACE/MONN
NetC?_CELL_8_INTERFACE_2: U?#3.18(VC8) ; sheet CELL 8 INTERFACE/MONP, sheet CELL 9 INTERFACE/CFREF, sheet CELL 9 INTERFACE/MONN
NetC?_CELL_9_INTERFACE_2: U?#3.17(VC9) ; sheet CELL 10 INTERFACE/CFREF, sheet CELL 10 INTERFACE/MONN, sheet CELL 9 INTERFACE/MONP
NetC?_CELL_10_INTERFACE_2: D?#1.A U?#3.16(VC10) ; sheet CELL 10 INTERFACE/MONP
NetD?#2_A: D?#2.A R?#3.2 R?#5.1
NetD?#2_K: D?#2.K Q2.D R?#5.2
NetF?#1_2: F?#1.2 Q?.1(D) R?#3.1 R?#4.1 R?#9.1
NetQ2_G: Q2.G R?#8.2
NetR?#6_2: R?#6.2 U?#3.13(TS2)
NetR?#11_2: R?#11.2 S?.2 ; port BMS BOOT REF

Not connected (* = marked no-connect by the designer): U?#2 10(PACKDIV)* 11(PACK)* 14(PCHG)* 16(CHG)*; U?#3 2(CHG)*

### Notes on the sheet
- This power port needs to be the same as on PSU sheet.
- PLEASE REVIEW AND CORRECT VALUES FOR ALL PASSIVES/ACTIVES
- See SLUA749A pp13-16 for REGSRC considerations.
- Might want to bring DSG and CHG into micro GPIO as status signals. Will give you a short amount of time to do any maintenance before MCU power supply is disconnected.
- Documents to review:
  SLUA749A: bq769x0 Family Top 10 Design Considerations
  SLUA769: bq769x0 Boot Switch Alternatives
- Need 1V minimum on TS1 for boot. Choose bias resistor to CVF1 accordingly in concert with boot opto characteristics.
- Not certain separating the VSS connection to cell is the right thing to do. Provision shorting link to VC0
- Revision History:
- Sheet Title:
- Rev
- Date
- Description
- Project:
- Size:
- Drawn By:
- A3
- Number:
- Revision:
- Sheet
- Version:
- of
- QUT Motorsport
- O-120, Gardens Point
- 2 George Street
- Brisbane, QLD 4000
- Australia
- Print Date:
- Print Time:
- File Name:

### Library data of the parts
C21 = Capacitor, Ceramic SMD 10uF 25V 10% X7R 1206: Manufacturer: Generic; MPN: Capacitor, Ceramic SMD 10uF 25V 10% X7R 1206; Supplier 1: Mouser; Supplier Part Number 1: 810-C3216X7R1E106K
C26 C28 C?#3 = Capacitor, Ceramic SMD 1uF 25V 10% X7R 0603: Manufacturer: Generic; MPN: Capacitor, Ceramic SMD 1uF 25V 10% X7R 0603; Supplier 1: Mouser; Supplier Part Number 1: 80-C0603C105K3R
C?#2 C?#4-C?#8 = CMP-2007-01110-1: Part Number: C0805C224J5RACTU; Manufacturer: Kemet
D?#1-D?#3 = MCL4448-TR3: Diode, Silicon, 75V 150mA MicroMELF; Manufacturer: Vishay Semiconductor Diodes Division; MPN: MCL4448-TR3; Supplier 1: Mouser; Supplier Part Number 1: 78-MCL4448-TR3
F?#1-F?#13 = Fuse 2: Fuse; Published: 8-Jun-2000; LatestRevisionDate: 17-Jul-2002; LatestRevisionNote: Re-released for DXP Platform.; PackageReference: PIN-W2/E2.8; Publisher: Altium Limited; PackageDescription: Thru-Hole; 2 Leads
P?#1 = Header 5: Header, 5-Pin; LatestRevisionDate: 17-Jul-2002; LatestRevisionNote: Re-released for DXP Platform.; Publisher: Altium Limited
P?#2 = Header 8: Header, 8-Pin; LatestRevisionDate: 17-Jul-2002; LatestRevisionNote: Re-released for DXP Platform.; Publisher: Altium Limited
Q2 = 2N7002K-7: MOSFET, n-ch, 60V 380mA 2R, SOT23-3; Manufacturer: Diodes Incorporated; MPN: 2N7002K-7; Supplier 1: Mouser; Supplier Part Number 1: 621-2N7002K-7
Q? = MOSFET-N: N-Channel MOSFET; Published: 8-Jun-2000; LatestRevisionDate: 17-Jul-2002; LatestRevisionNote: Re-released for DXP Platform.; PackageVersion: 1995/1996; PackageReference: E3; Publisher: Altium Limited; PackageDescription: TO, Flat Index; 3 In-Line, Axial Leads; Body Dia. 4.6mm; Lead Dia. 0.5 mm (max)
R?#2-R?#14 = Resistor, SMD 10k 1% 0603: Manufacturer: Generic; MPN: Resistor, SMD 10k 1% 0603; Supplier 1: Mouser; Supplier Part Number 1: 603-RC0603FR-0710KL
S? = SW-PB: Switch; Published: 24-Mar-1999; LatestRevisionDate: 17-Jul-2002; LatestRevisionNote: Re-released for DXP Platform.; PackageReference: SPST-2; Publisher: Altium Limited; PackageDescription: Switch; 2 Leads
U?#2 = BQ76200PWR: High-voltage battery pack front-end charge/discharge high-side NFET driver; Manufacturer: Texas Instruments; MPN: BQ76200PWR
U?#3 = BQ76930: Battery Monitoring/Fuel Gauge Li-Ion/Li-Polymer/LiFePO4 0V to 16V 30-Pin TSSOP T/R; InternalPart: Test1234; Manufacturer: Texas Instruments; Manufacturer Part Number: BQ7693003DBTR; Operating Supply Voltage: 25V; Interface: I2C; Fault Protection: Over Current,Short Circuit,Over/Under Voltage; Supplier 1: Digi-Key; RoHS: Yes; Category: Battery Management; Stock 1: 4521; Pricing 1: 1=4.66000, 10=4.18900, 25=3.96000, 100=3.25600, 250=2.92160, 500=2.81600, 1000=2.34080 (USD); Mount: Surface Mount; Case/Package: TFSOP; Number of Pins: 30; Weight: 0.003439oz; Contact Plating: Gold; Min Operating Temperature: -40°C; Max Operating Temperature: 85°C; Output Voltage: 16V; Packaging: Tape and Reel; Package Quantity: 2000; Lead Free: Lead Free; ComponentLink1URL: http://www.ti.com/lit/gpn/bq76930?src-supplier=Mouser; ComponentLink1Description: http://www.ti.com/lit/gpn/bq76930?src-supplier=Mouser; ComponentLink2URL: http://www.ti.com/lit/ds/symlink/bq76930.pdf?src-supplier=Digi-Key; ComponentLink2Description: http://www.ti.com/lit/ds/symlink/bq76930.pdf?src-supplier=Digi-Key; ComponentLink3URL: http://www.ti.com/lit/pdf/slpt038?src-supplier=Digi-Key; ComponentLink3Description: http://www.ti.com/lit/pdf/slpt038?src-supplier=Digi-Key; ComponentLink4URL: http://www.ti.com/general/docs/lit/getliterature.tsp?genericPartNumber=BQ76920&amp;&amp;fileType=pdf&src-supplier=Avnet+Asia; ComponentLink4Description: http://www.ti.com/general/docs/lit/getliterature.tsp?genericPartNumber=BQ76920&amp;&amp;fileType=pdf&src-supplier=Avnet+Asia; ComponentLink5URL: http://www.ti.com/general/docs/lit/getliterature.tsp?genericPartNumber=BQ76920&&fileType=pdf&src-supplier=Avnet; ComponentLink5Description: http://www.ti.com/general/docs/lit/getliterature.tsp?genericPartNumber=BQ76920&&fileType=pdf&src-supplier=Avnet; Supplier Part Number 1: 296-39961-1-ND

## Sheet ExternalBalancing.SchDoc: Cell Balancing
size A3; DrawnBy: Sam Haines; DocumentNumber: 6; Revision: 01; SheetNumber: 6; SheetTotal: 10; Version: 01; Project: Battery Managment System 2020; PageSetup: Record=PageOptions|CenterHorizontal=True|CenterVertical=True|PrintScale=0.97|XCorrection=1.00|YCorrection=1.00|PrintKind=0|BorderSize=5000000|LeftOffset=0|BottomOffset=0|Orientation=2|PaperLength=1000|PaperWidth=1000|Scale=100|PaperSource=7|PrintQuality=-4|MediaType=1|DitherType=10|PaperKind=A4|PrintScaleMode=1
Used 10 times, as channels Cell Monitor and Front End/CELL 10 INTERFACE, Cell Monitor and Front End/CELL 1 INTERFACE, Cell Monitor and Front End/CELL 2 INTERFACE, Cell Monitor and Front End/CELL 3 INTERFACE, Cell Monitor and Front End/CELL 4 INTERFACE, Cell Monitor and Front End/CELL 5 INTERFACE, Cell Monitor and Front End/CELL 6 INTERFACE, Cell Monitor and Front End/CELL 7 INTERFACE, Cell Monitor and Front End/CELL 8 INTERFACE, Cell Monitor and Front End/CELL 9 INTERFACE. Parts and nets are listed once, with the designators drawn on the sheet.
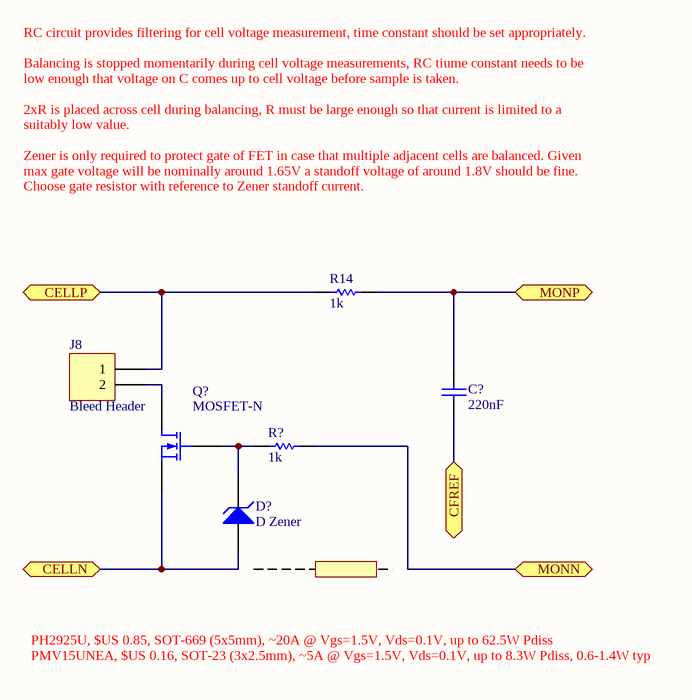
[diagram p5: ExternalBalancing.SchDoc]

### Parts
C?  220nF  [CAPC2013X145X50ML20T25]
D?  D Zener  [DIODE-0.7]
J8  Bleed Header  [HDR1X2]
Q?  MOSFET-N  [E3]
R14  1k  [RESC1608X55X30ML15T15]
R?  1k  [RESC1608X55X30ML15T15]

### Ports
CELLN (bidir), CELLP (bidir), CFREF (bidir), MONN (bidir), MONP (bidir)

### Nets
CELLN: D?.1(A) Q?.3(S) ; port CELLN
CELLP: J8.1 R14.1 ; port CELLP
CFREF: C?.1 ; port CFREF
MONN: R?.2 ; port MONN
MONP: C?.2 R14.2 ; port MONP
NetD?_2: D?.2(K) Q?.2(G) R?.1
NetJ8_2: J8.2 Q?.1(D)

### Channels
Cell Monitor and Front End/CELL 10 INTERFACE: designators end in _CELL_10_INTERFACE; ports CELLN=CVF9 CELLP=CVF10 CFREF=NetC?_CELL_9_INTERFACE_2 MONN=NetC?_CELL_9_INTERFACE_2 MONP=NetC?_CELL_10_INTERFACE_2
Cell Monitor and Front End/CELL 1 INTERFACE: designators end in _CELL_1_INTERFACE; ports CELLN=CVF0 CELLP=CVF1 CFREF=CF0 MONN=NetC?#8_2 MONP=NetC?_CELL_1_INTERFACE_2
Cell Monitor and Front End/CELL 2 INTERFACE: designators end in _CELL_2_INTERFACE; ports CELLN=CVF1 CELLP=CVF2 CFREF=NetC?_CELL_1_INTERFACE_2 MONN=NetC?_CELL_1_INTERFACE_2 MONP=NetC?_CELL_2_INTERFACE_2
Cell Monitor and Front End/CELL 3 INTERFACE: designators end in _CELL_3_INTERFACE; ports CELLN=NetD?_CELL_3_INTERFACE_1 CELLP=CVF3 CFREF=NetC?_CELL_2_INTERFACE_2 MONN=NetC?_CELL_2_INTERFACE_2 MONP=NetC?_CELL_3_INTERFACE_2
Cell Monitor and Front End/CELL 4 INTERFACE: designators end in _CELL_4_INTERFACE; ports CELLN=CVF3 CELLP=CVF4 CFREF=NetC?_CELL_3_INTERFACE_2 MONN=NetC?_CELL_3_INTERFACE_2 MONP=NetC?_CELL_4_INTERFACE_2
Cell Monitor and Front End/CELL 5 INTERFACE: designators end in _CELL_5_INTERFACE; ports CELLN=CVF4 CELLP=CVF5 CFREF=NetC?_CELL_4_INTERFACE_2 MONN=NetC?_CELL_4_INTERFACE_2 MONP=NetC?_CELL_5_INTERFACE_2
Cell Monitor and Front End/CELL 6 INTERFACE: designators end in _CELL_6_INTERFACE; ports CELLN=CVF5 CELLP=CVF6 CFREF=VC5X MONN=NetC?#7_2 MONP=NetC?_CELL_6_INTERFACE_2
Cell Monitor and Front End/CELL 7 INTERFACE: designators end in _CELL_7_INTERFACE; ports CELLN=CVF6 CELLP=CVF7 CFREF=NetC?_CELL_6_INTERFACE_2 MONN=NetC?_CELL_6_INTERFACE_2 MONP=NetC?_CELL_7_INTERFACE_2
Cell Monitor and Front End/CELL 8 INTERFACE: designators end in _CELL_8_INTERFACE; ports CELLN=CVF7 CELLP=CVF8 CFREF=NetC?_CELL_7_INTERFACE_2 MONN=NetC?_CELL_7_INTERFACE_2 MONP=NetC?_CELL_8_INTERFACE_2
Cell Monitor and Front End/CELL 9 INTERFACE: designators end in _CELL_9_INTERFACE; ports CELLN=CVF8 CELLP=CVF9 CFREF=NetC?_CELL_8_INTERFACE_2 MONN=NetC?_CELL_8_INTERFACE_2 MONP=NetC?_CELL_9_INTERFACE_2

### Notes on the sheet
- RC circuit provides filtering for cell voltage measurement, time constant should be set appropriately.
  Balancing is stopped momentarily during cell voltage measurements, RC tiume constant needs to be low enough that voltage on C comes up to cell voltage before sample is taken.
  2xR is placed across cell during balancing, R must be large enough so that current is limited to a suitably low value.
  Zener is only required to protect gate of FET in case that multiple adjacent cells are balanced. Given max gate voltage will be nominally around 1.65V a standoff voltage of around 1.8V should be fine. Choose gate resistor with reference to Zener standoff current.
- PH2925U, $US 0.85, SOT-669 (5x5mm), ~20A @ Vgs=1.5V, Vds=0.1V, up to 62.5W Pdiss
  PMV15UNEA, $US 0.16, SOT-23 (3x2.5mm), ~5A @ Vgs=1.5V, Vds=0.1V, up to 8.3W Pdiss, 0.6-1.4W typ
- Revision History:
- Sheet Title:
- Rev
- Date
- Description
- Project:
- Size:
- Drawn By:
- A3
- Number:
- Revision:
- Sheet
- Version:
- of
- QUT Motorsport
- O-120, Gardens Point
- 2 George Street
- Brisbane, QLD 4000
- Australia
- Print Date:
- Print Time:
- File Name:

### Library data of the parts
C? = CMP-2007-01110-1: as C?#2 on sheet CellMonitor
D? = D Zener: Zener Diode; Published: 8-Jun-2000; LatestRevisionDate: 17-Jul-2002; LatestRevisionNote: Re-released for DXP Platform.; PackageReference: DIODE-0.7; Publisher: Altium Limited; PackageDescription: Diode, Thru-Hole; 2 Leads; 0.7 in Pin Spacing
J8 = Header 2: Header, 2-Pin; LatestRevisionDate: 17-Jul-2002; LatestRevisionNote: Re-released for DXP Platform.; Publisher: Altium Limited
Q? = MOSFET-N: N-Channel MOSFET; Published: 8-Jun-2000; LatestRevisionDate: 17-Jul-2002; LatestRevisionNote: Re-released for DXP Platform.; PackageVersion: 1995/1996; PackageReference: E3; Publisher: Altium Limited; PackageDescription: TO, Flat Index; 3 In-Line, Axial Leads; Body Dia. 4.6mm; Lead Dia. 0.5 mm (max)
R14 R? = CMP-2000-00703-1: as R3 on sheet MCU

## Sheet PSU_Disconnect.SchDoc: Power Supply (20-40V to 3v3 @ 0.1-0.6A)
size A3; DrawnBy: Jonn Dillon; DocumentNumber: 10; Revision: 01; SheetNumber: 10; SheetTotal: 10; Version: 01; Project: Battery Management System 2020; PageSetup: Record=PageOptions|CenterHorizontal=True|CenterVertical=True|PrintScale=0.97|XCorrection=1.00|YCorrection=1.00|PrintKind=0|BorderSize=5000000|LeftOffset=0|BottomOffset=0|Orientation=2|PaperLength=1000|PaperWidth=1000|Scale=100|PaperSource=7|PrintQuality=-4|MediaType=1|DitherType=10|PaperKind=A4|PrintScaleMode=1
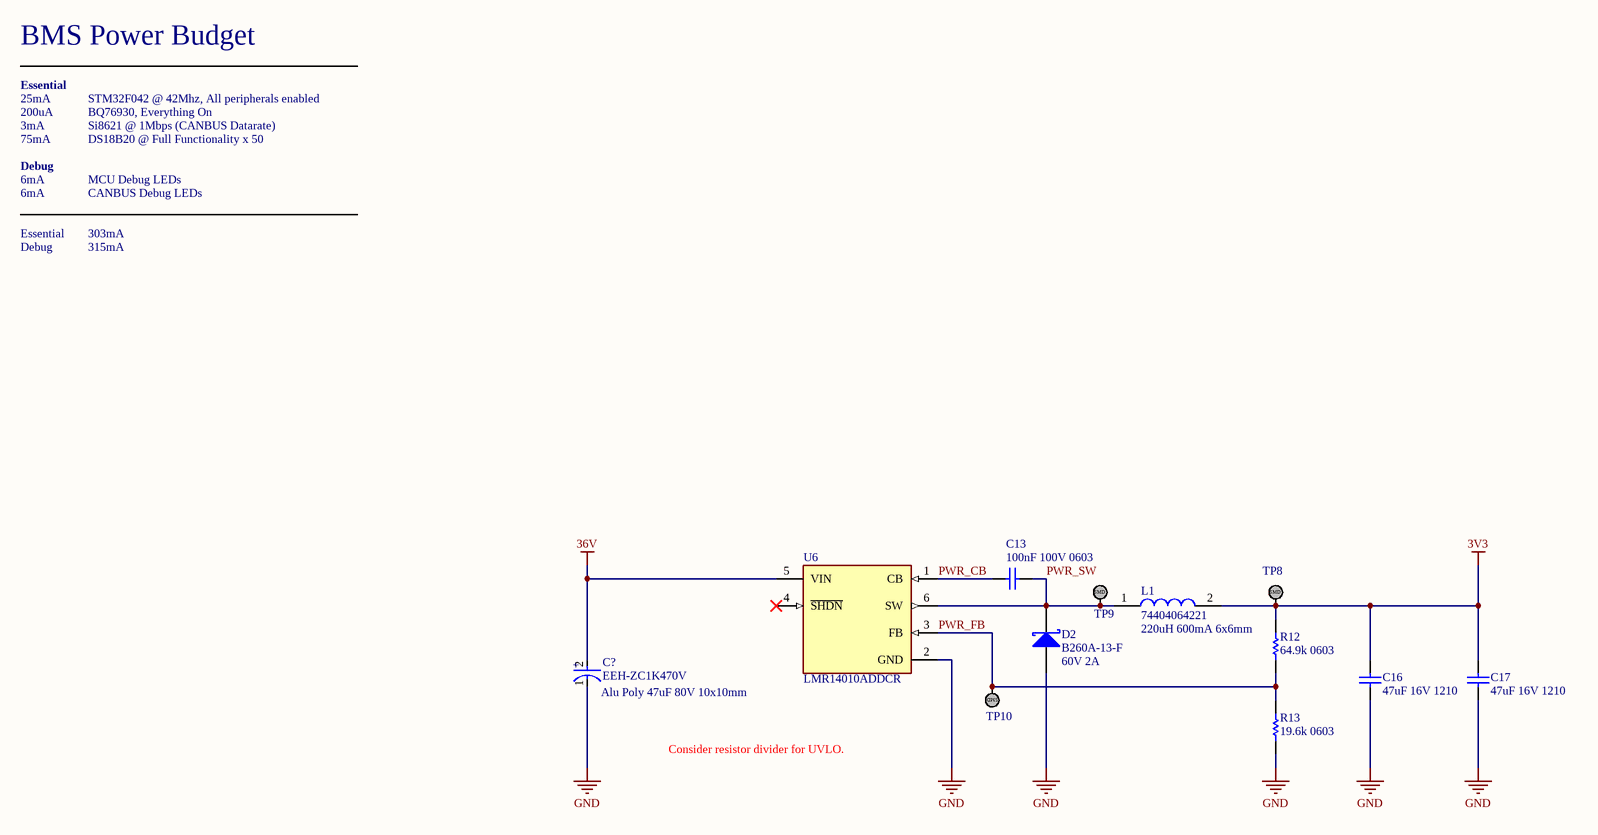
[diagram p6: PSU_Disconnect.SchDoc]

### Parts
(Parts that share a designator on the sheet are numbered #1, #2 ... from top to bottom, then left to right.)
C13  100nF 100V 0603  [CAPC1608X90X20ML10]
C16  47uF 16V 1210  [MURA-1210_H_2.7_L]
C17  47uF 16V 1210  [MURA-1210_H_2.7_L]
C?#9  EEH-ZC1K470V  [FP-ZCG-V-MFG]
D2  B260A-13-F  [DIOD-SMA-2_V]
L1  74404064221  [Inductor_6x6mm]
R12  64.9k 0603  [RESC1608X55X30ML15T15]
R13  19.6k 0603  [RESC1608X55X30ML15T15]
TP8  TestPoint_SMD  [TestPointSMD]  (value not drawn)
TP9  TestPoint_SMD  [TestPointSMD]  (value not drawn)
TP10  TestPoint_SMD  [TestPointSMD]  (value not drawn)
U6  LMR14010ADDCR  [FP-DDC0006A-MFG]

### Nets
3V3: C16.2 C17.2 L1.2 R12.2 TP8.1
36V: C?#9.2(A) U6.5(VIN)
GND: C16.1 C17.1 C?#9.1(C) D2.1(A) R13.1 U6.2(GND)  [project net CF0]
PWR_CB: C13.2 U6.1(CB)
PWR_FB: R12.1 R13.2 TP10.1 U6.3(FB)
PWR_SW: C13.1 D2.2(K) L1.1 TP9.1 U6.6(SW)

Not connected (* = marked no-connect by the designer): U6 4(~{SHDN})*

### Notes on the sheet
- BMS Power Budget
- 25mA
- 200uA
- Essential
- STM32F042 @ 42Mhz, All peripherals enabled
- BQ76930, Everything On
- 3mA
- 6mA
- Debug
- 75mA
- Si8621 @ 1Mbps (CANBUS Datarate)
- MCU Debug LEDs
- DS18B20 @ Full Functionality x 50
- CANBUS Debug LEDs
- 303mA
- 315mA
- (near L1) 220uH 600mA 6x6mm
- (near C?#9) Alu Poly 47uF 80V 10x10mm
- (near D2) 60V 2A
- Consider resistor divider for UVLO.
- Revision History:
- Sheet Title:
- Rev
- Date
- Description
- Project:
- Size:
- Drawn By:
- A3
- Number:
- Revision:
- Sheet
- Version:
- of
- QUT Motorsport
- O-120, Gardens Point
- 2 George Street
- Brisbane, QLD 4000
- Australia
- Print Date:
- Print Time:
- File Name:
- (in symbol CMP-05428-000002-1) +
- (in symbol TestPoint_SMD) SMD

### Library data of the parts
C13 = CMP-2000-04983-1: Chip Capacitor, 100 nF, +/- 10%, 100 V, -55 to 125 degC, 0603 (1608 Metric), RoHS, Tape and Reel; PCN Part Number: MLCCPartNumberChange30/Nov/2012; Manufacturer: TDK; Capacitance: 0.1µF; Kits: 445-9007-KIT-ND-KITCAPCERAUTO100V-600VSMD445-9006-KIT-ND-KITCAPCERAUTO100V-630VSMDSAMPLEKIT1006-ND-KITCAPCERAUTO100V-630V; Online Catalog: CGASeries,AutomotiveGeneral,MidandHighVoltage; Product Training Modules: CGASeriesforAutomotiveApplicationsSEAT,CCV,andTVCLDesignToolsGuidetoReplacinganElectrolyticCapacitorwithanMLCC; Featured Product: CGASeriesMLCCCapacitors; Other Names: 445-6938-1; Temperature Coefficient: X7S; RoHS Information: RoHSCertificate-MLCC; Package / Case: 0603(1608Metric); Mounting Type: SurfaceMount,MLCC; Size / Dimension: 0.063"Lx0.031"W(1.60mmx0.80mm); Applications: Automotive; Series: CGA; Package Reference: 603; Voltage - Rated: 100V; Lead Style: -; Datasheet URL: https://ciiva.com/datasheet-click-20384029?src=ciiva&sig=1463c8bc; Thickness (Max): 0.035"(0.90mm); Ratings: AEC-Q200; Standard Package: 1; Features: -; Family: CeramicCapacitors; Category: Capacitors; Tolerance: ±10%; Datasheet Version: Jan-16; Operating Temperature: -55degC~125degC; Manufacturer URL: http://www.tdk.com/; Packaging: CutTape(CT); Lead Spacing: -; Package Description: 2-Pin Surface Mount Device, Body 1.6 x 0.8 mm; Height - Seated (Max): -
C16 C17 = CMP-2000-06362-1: Cap Ceramic, 47 uF, +/- 10%, -55 to 85 degC, 2-Pin SMD (1210), RoHS, Tape and Reel; Manufacturer: Murata; Catalog Drawings: GRMSeries_1210_2.5; Capacitance: 47µF; Product Training Modules: High-CapMultilayerCeramicCapacitors; Temperature Coefficient: X5R; Online Catalog: GRMSeries; Other Names: 490-6539-6; Lead Style: -; Voltage Rating DC: 16V; Datasheet URL: http://psearch.en.murata.com/capacitor/product/GRM32ER61C476KE15%23.pdf; Package Description: 2-Pin Surface Mount Device, Body 3.2 x 2.5 mm; Applications: GeneralPurpose; Thickness (Max): 0.106"(2.70mm); Operating Temperature: -55°C~85°C; Mounting Technology: SurfaceMount; Category: Capacitors; Package / Case: 1210(3225Metric); Mounting Type: SurfaceMount,MLCC; Ratings: -; Package Reference: 1210; Height - Seated (Max): -; Series: GRM; Lead Spacing: -; Family: CeramicCapacitors; Datasheet Version: 04/2016; Tolerance: ±10%; Size / Dimension: 0.126"Lx0.098"W(3.20mmx2.50mm); Packaging: Digi-Reel®; Voltage - Rated: 16V; Standard Package: 1; Features: -; Manufacturer URL: http://www.murata.com/
C?#9 = CMP-05428-000002-1: CAP ALUM POLY 47UF 20% 80V SMD; Manufacturer: Panasonic; Leakage Current: 37.6uA; Life: 100000Hours; Standoff Height: 0mm; Esr: 36mΩ; Material: Polymer; Dissipation Factor: 8%; Automotive Grade: Grade 1; Ripple Current: 1360mA; Footprint Url: https://industrial.panasonic.com/cdbs/www-data/pdf/RDD0000/DMD0000COL4.pdf; Digikey Description: CAP ALUM POLY 47UF 20% 80V SMD; Device Class L1: Passive Components; Category: Cap; Tolerance: 20%; Value: 47uF; Manufacturer Part Number: EEH-ZC1K470V; Device Class L3: Polymer Capacitors; Temperature Range Low: -55°C; RoHS: TRUE; Package: ZCG-V; Octopart: https://octopart.com/eeh-zc1k470v-panasonic-75386549; Device Class L2: Capacitors; Capacitance: 47uF; Voltage Rating: 80V; ComponentLink2Description: Datasheet; Temperature: -55°C to +125°C; Automotive: Yes; Temperature Range High: +125°C; Lead Free: Yes; ComponentLink2URL: https://industrial.panasonic.com/cdbs/www-data/pdf/RDD0000/ABA0000C1234.pdf; Mouser Description: Cap Aluminum 47uF 80V 20% (10 X 10.5mm) Cylindrical 0.036 Ohm 1360mA 4000 hr 125°C Emboss T/R; Height: 10.8mm
D2 = CMP-2000-04933-1: Schottky Barrier Rectifier, 60 V, 2 A, -65 to 150 degC, 2-Pin SMA, RoHS, Tape and Reel; If - Forward Current: 2A; Vf - Forward Voltage: 0.7V; Ir - Reverse Current: 500uA; Configuration: Single; Unit Weight: 0.002258oz; Brand: DiodesIncorporated; Vrrm - Repetitive Reverse Voltage: 60V; Ifsm - Forward Surge Current: 50A; Product Category: SchottkyDiodes&Rectifiers; Datasheet Version: Rev. 22-2, 07/2015; Maximum Operating Temperature: +150C; Product: SchottkyDiodes; Minimum Operating Temperature: -65C; Operating Temperature Range: -65Cto+150C; Termination Style: SMD/SMT; Package / Case: SMA; Factory Pack Quantity: 5000; Technology: Si; Height: 2.1mm; Type: SchottkyBarrierRectifier; Manufacturer URL: http://www.diodes.com/; Datasheet URL: http://www.diodes.com/_files/datasheets/ds13004.pdf; RoHS: True; Mounting Style: SMD/SMT; Length: 4.6mm; Series: B260; Package Reference: SMA-2; Packaging: Reel; Width: 2.92mm; Manufacturer: DiodesIncorporated; Package Description: 2-Pin Surface Mounted Assembly, Body 4.3 x 2.605 mm, Height 2.4 mm
L1 = 74404064221: FIXED IND 220UH 660MA 850 MOHM; ComponentLink1Description: Digikey; ComponentLink1URL: https://www.digikey.com.au/product-detail/en/w%C3%BCrth-elektronik/74404064221/732-7261-1-ND/5353241; ComponentLink2Description: LCSC A; ComponentLink2URL: https://lcsc.com/product-detail/Power-Inductors_Sunlord-SWPA6045S221MT_C91047.html; ComponentLink3Description: LCSC B; ComponentLink3URL: https://lcsc.com/product-detail/Power-Inductors_SXN-Shun-Xiang-Nuo-Elec-SMNR6045-221MT_C467145.html
R12 = CMP-2000-00605-1: Part Number: ERJ-3EKF6492V; Manufacturer: Panasonic
R13 = CMP-2000-00314-1: Part Number: ERJ-3EKF1962V; Manufacturer: Panasonic
U6 = CMP-04918-000056-1: IC REG BUCK ADJ 1A TSOT23-6; Manufacturer: Texas Instruments; Max Junction Temp: +125°C; Number Of Outputs: 1; Standoff Height: 0mm; Switching Frequency: 700kHz; Min Supply Voltage: 4V; Max Supply Voltage: 40V; Max Duty Cycle: 96%; Output Type: AdjustableProgrammable; Manufacturer Part Number: LMR14010ADDCR; Temperature: -40°C to +125°C; Output Current: 1A; Category: IC; Temperature Range High: +125°C; Lead Free: Yes; Switching Topology: Buck; Mouser Description: 4-V to 40-V, 1-A Step-Down Converter With High Efficiency Eco-Mode 6-SOT-23-THIN -40 to 125; Device Class L1: Integrated Circuits (ICs); Digikey Description: IC REG BUCK ADJ 1A TSOT23-6; Package: DDC0006A; Ipc Land Pattern Name: SOT95P280X110-6; Device Class L2: Power Management ICs; Temperature Range Low: -40°C; Height: 1.1mm; Device Class L3: Voltage Regulators - Switching; RoHS: TRUE; Automotive: No; Octopart: https://octopart.com/lmr14010addcr-texas+instruments-90753290; ComponentLink2URL: https://www.ti.com/lit/ds/symlink/lmr14010a.pdf; ComponentLink2Description: Datasheet

## Sheet TemperatureSensor.SchDoc: Extra Temperature Connection
size A4; DrawnBy: Jonn Dillon; DocumentNumber: 8; Revision: 01; SheetNumber: 8; SheetTotal: 10; Version: 01; Project: Battery Managment System 2020; PageSetup: Record=PageOptions|CenterHorizontal=True|CenterVertical=True|PrintScale=0.97|XCorrection=1.00|YCorrection=1.00|PrintKind=0|BorderSize=5000000|LeftOffset=0|BottomOffset=0|Orientation=2|PaperLength=1000|PaperWidth=1000|Scale=100|PaperSource=7|PrintQuality=-4|MediaType=1|DitherType=10|PaperKind=A4|PrintScaleMode=1
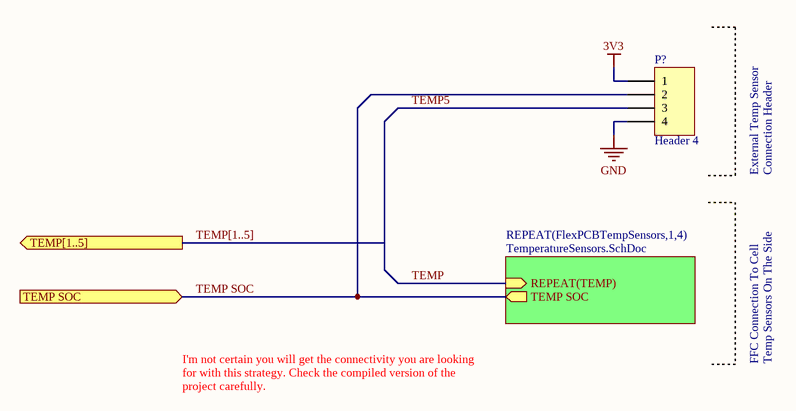
[diagram p7: TemperatureSensor.SchDoc]

### Parts
(Parts that share a designator on the sheet are numbered #1, #2 ... from top to bottom, then left to right.)
P?#3  Header 4  [HDR1X4]

### Sub-sheets
REPEAT(FlexPCBTempSensors,1,4) = TemperatureSensors.SchDoc: REPEAT(TEMP) (in), TEMP SOC (out)

### Ports
TEMP SOC (in), TEMP[1..5] (out)

### Nets
3V3: P?#3.1
GND: P?#3.4  [project net CF0]
TEMP: sheet REPEAT(FlexPCBTempSensors,1,4)/REPEAT(TEMP)
TEMP5: P?#3.3
TEMP SOC: P?#3.2 ; port TEMP SOC, sheet REPEAT(FlexPCBTempSensors,1,4)/TEMP SOC

### Buses and harness runs
bus TEMP[1..5] = port TEMP[1..5]

### Notes on the sheet
- External Temp Sensor
- Connection Header
- I'm not certain you will get the connectivity you are looking for with this strategy. Check the compiled version of the project carefully.
- FFC Connection To Cell
- Temp Sensors On The Side
- Revision History:
- Sheet Title:
- Rev
- Date
- Description
- Project:
- Size:
- Drawn By:
- A3
- Number:
- Revision:
- Sheet
- Version:
- of
- QUT Motorsport
- O-120, Gardens Point
- 2 George Street
- Brisbane, QLD 4000
- Australia
- Print Date:
- Print Time:
- File Name:

### Library data of the parts
P?#3 = Header 4: Header, 4-Pin; LatestRevisionDate: 17-Jul-2002; LatestRevisionNote: Re-released for DXP Platform.; Publisher: Altium Limited